# Altium project STM32MP15XXAB_1DDR3Lx16.PrjPcb
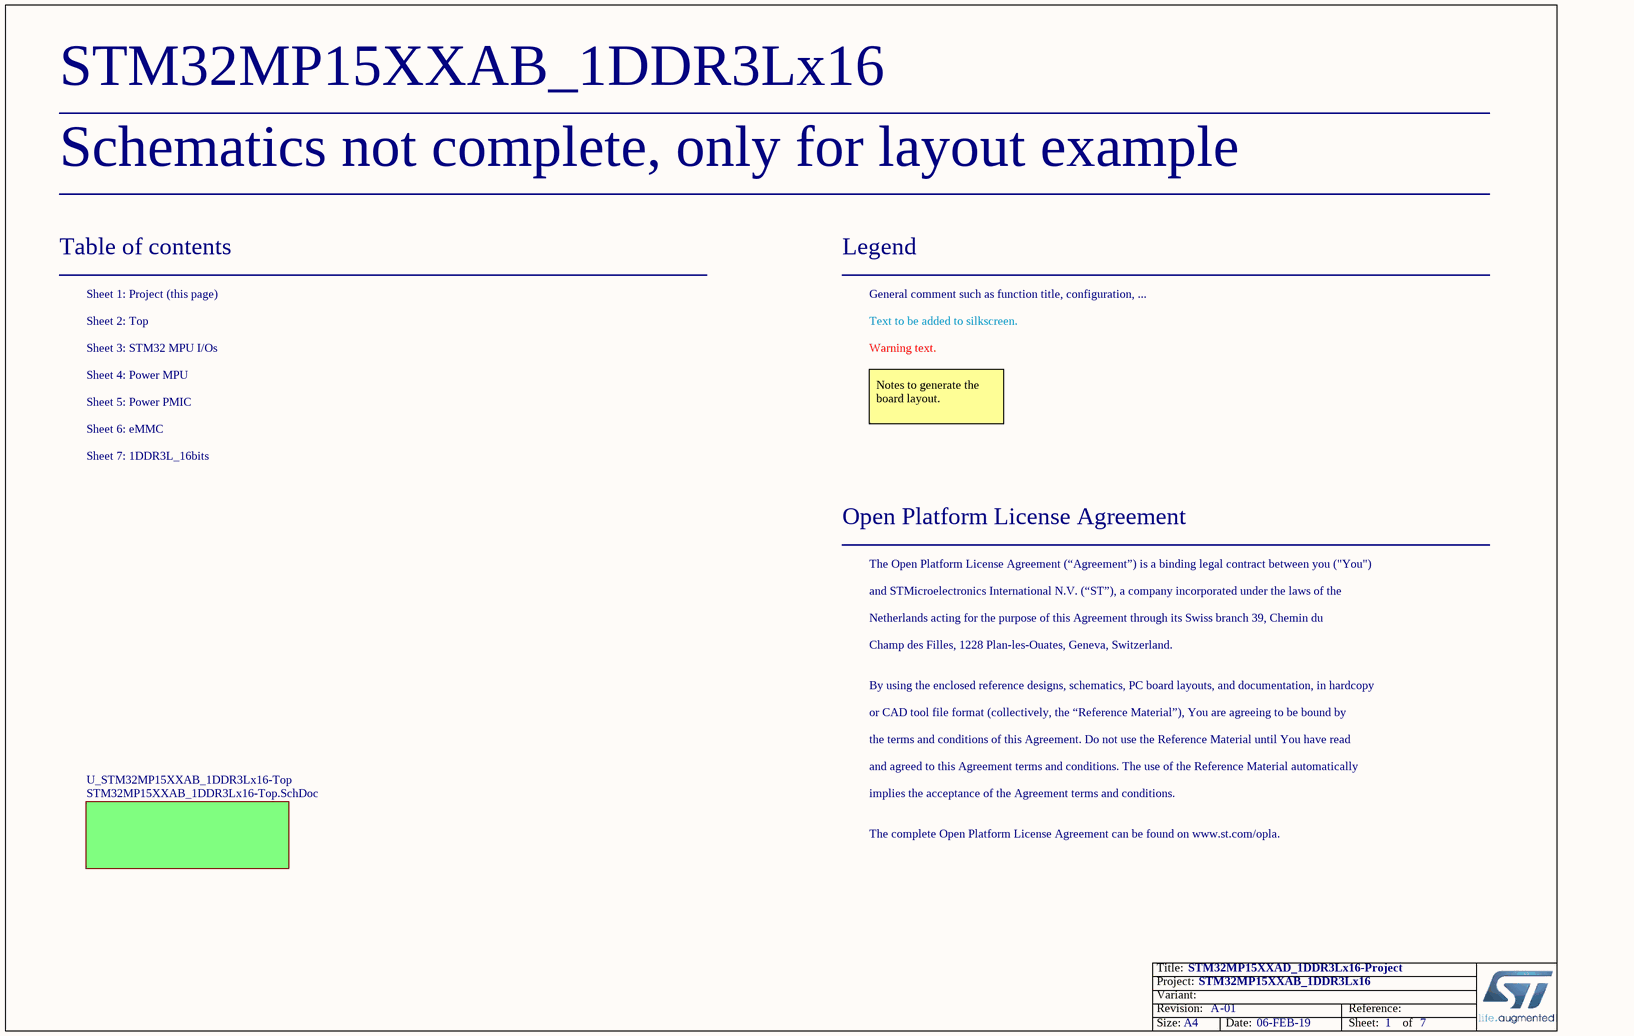
[diagram p0: STM32MP15XXAB_1DDR3Lx16-Project.SchDoc]
Board_Assembly_Revision: 01; Board_Document_Date: 06-FEB-19; Board_Name: STM32MP15XXAB_1DDR3Lx16; Board_PCB_Revision: A
7 sheets, 144 parts. Net scope: flat (ports and power ports of the same name join across sheets).
Board file: STM32MP15XXAB_1DDR3Lx16_A01.PcbDoc
Sheets:
  STM32MP15XXAB_1DDR3Lx16-Project.SchDoc
    U_STM32MP15XXAB_1DDR3Lx16-Top = STM32MP15XXAB_1DDR3Lx16-Top.SchDoc
      U_Power_PMIC = Power_PMIC.SchDoc
      U_Power_MPU = Power_MPU.SchDoc
      U_eMMC = eMMC.SchDoc
      U_STM32_MPU_IOs = STM32_MPU_IOs.SchDoc
      U_1DDR3L_16bits = 1DDR3L_16bits.SchDoc

## Sheet STM32MP15XXAB_1DDR3Lx16-Project.SchDoc: STM32MP15XXAD_1DDR3Lx16-Project
size A4; ApprovedBy: Not used; CheckedBy: Not used; Author: Not used; CompanyName: STMicroelectronics; DrawnBy: Not used; Engineer: Not used; Organization: Not used; Address1: Not used; Address2: Not used; Address3: Not used; Address4: Not used; DocumentNumber: Not used; Revision: Not used; SheetNumber: 1; SheetTotal: 7; CurrentTime: Not used; CurrentDate: Not used; Time: Not used; DocumentFullPathAndName: Not used; DocumentName: Not used; ModifiedDate: Not used; ImagePath: Not used; ProjectName: Not used; Application_BuildNumber: Not used

### Sub-sheets
U_STM32MP15XXAB_1DDR3Lx16-Top = STM32MP15XXAB_1DDR3Lx16-Top.SchDoc: no entries

### Notes on the sheet
- Schematics not complete, only for layout example
- Table of contents
- Sheet 1: Project (this page)
- Legend
- General comment such as function title, configuration, ...
- Sheet 2: Top
- Sheet 3: STM32 MPU I/Os
- Sheet 4: Power MPU
- Text to be added to silkscreen.
- Warning text.
- Sheet 5: Power PMIC
- Sheet 6: eMMC
- Notes to generate the board layout.
- Sheet 7: 1DDR3L_16bits
- Open Platform License Agreement
- The Open Platform License Agreement (“Agreement”) is a binding legal contract between you ("You")
- and STMicroelectronics International N.V. (“ST”), a company incorporated under the laws of the
- Netherlands acting for the purpose of this Agreement through its Swiss branch 39, Chemin du
- Champ des Filles, 1228 Plan-les-Ouates, Geneva, Switzerland.
- By using the enclosed reference designs, schematics, PC board layouts, and documentation, in hardcopy
- or CAD tool file format (collectively, the “Reference Material”), You are agreeing to be bound by
- the terms and conditions of this Agreement. Do not use the Reference Material until You have read
- and agreed to this Agreement terms and conditions. The use of the Reference Material automatically
- implies the acceptance of the Agreement terms and conditions.
- The complete Open Platform License Agreement can be found on www.st.com/opla.
- Title:
- Project:
- Size:
- Revision:
- Variant:
- A4
- -
- Date:
- Reference:
- Sheet:
- of

## Sheet STM32MP15XXAB_1DDR3Lx16-Top.SchDoc: STM32MP15XXAD_1DDR3Lx16-TOP
size A4; Date: Not used; ApprovedBy: Not used; CheckedBy: Not used; Author: Not used; CompanyName: STMicroelectronics; DrawnBy: Not used; Engineer: Not used; Organization: Not used; Address1: Not used; Address2: Not used; Address3: Not used; Address4: Not used; DocumentNumber: Not used; Revision: Not used; SheetNumber: 2; SheetTotal: 7; CurrentTime: Not used; CurrentDate: Not used; Time: Not used; DocumentFullPathAndName: Not used; DocumentName: Not used; ModifiedDate: Not used; ImagePath: Not used; ProjectName: Not used; Application_BuildNumber: Not used
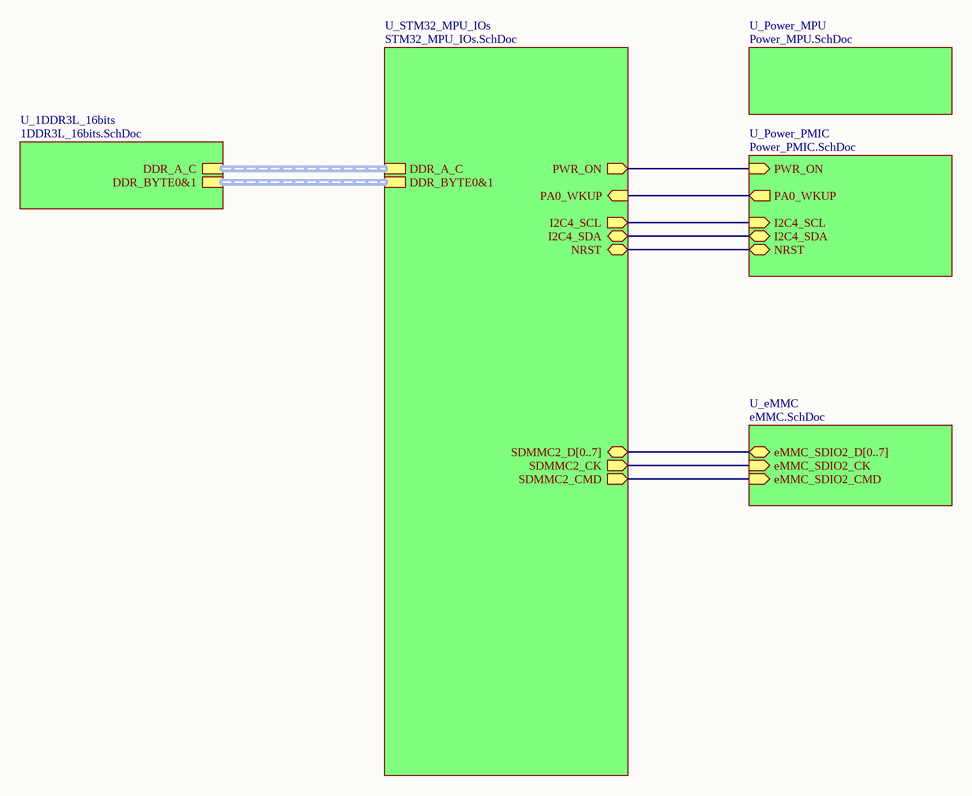
[diagram p1: STM32MP15XXAB_1DDR3Lx16-Top.SchDoc]

### Sub-sheets
U_1DDR3L_16bits = 1DDR3L_16bits.SchDoc: DDR_BYTE0&1 (harness DDR_BYTE_0&1), DDR_A_C (harness DDR_A_C)
U_eMMC = eMMC.SchDoc: eMMC_SDIO2_CK (in), eMMC_SDIO2_D[0..7] (bidir), eMMC_SDIO2_CMD (in)
U_Power_MPU = Power_MPU.SchDoc: no entries
U_Power_PMIC = Power_PMIC.SchDoc: I2C4_SDA (bidir), I2C4_SCL (in), PA0_WKUP (out), NRST (bidir), PWR_ON (in)
U_STM32_MPU_IOs = STM32_MPU_IOs.SchDoc: PA0_WKUP (in), NRST (bidir), PWR_ON (out), I2C4_SCL (out), I2C4_SDA (bidir), DDR_BYTE0&1 (harness DDR_BYTE_0&1), DDR_A_C (harness DDR_A_C), SDMMC2_D[0..7] (bidir), SDMMC2_CMD (out), SDMMC2_CK (out)

### Nets
(unnamed): sheet U_Power_PMIC/I2C4_SDA, sheet U_STM32_MPU_IOs/I2C4_SDA
(unnamed): sheet U_Power_PMIC/I2C4_SCL, sheet U_STM32_MPU_IOs/I2C4_SCL
(unnamed): sheet U_Power_PMIC/PA0_WKUP, sheet U_STM32_MPU_IOs/PA0_WKUP
(unnamed): sheet U_Power_PMIC/NRST, sheet U_STM32_MPU_IOs/NRST
(unnamed): sheet U_Power_PMIC/PWR_ON, sheet U_STM32_MPU_IOs/PWR_ON
(unnamed): sheet U_eMMC/eMMC_SDIO2_CK, sheet U_STM32_MPU_IOs/SDMMC2_CK
(unnamed): sheet U_eMMC/eMMC_SDIO2_CMD, sheet U_STM32_MPU_IOs/SDMMC2_CMD

### Buses and harness runs
bus sheet U_eMMC/eMMC_SDIO2_D[0..7] = sheet U_STM32_MPU_IOs/SDMMC2_D[0..7]
harness sheet U_1DDR3L_16bits/DDR_A_C = sheet U_STM32_MPU_IOs/DDR_A_C
harness sheet U_1DDR3L_16bits/DDR_BYTE0&1 = sheet U_STM32_MPU_IOs/DDR_BYTE0&1

### Notes on the sheet
- Title:
- Project:
- Size:
- Revision:
- Variant:
- A4
- -
- Date:
- Reference:
- Sheet:
- of

## Sheet Power_PMIC.SchDoc: Power_PMIC
size A3; CompanyName: STMicroelectronics; Organization: Microcontrollers Division; Address1: 12, Rue Jules HOROWITZ; Address2: 38019 Grenoble; Address3: FRANCE; SheetNumber: 5; SheetTotal: 7
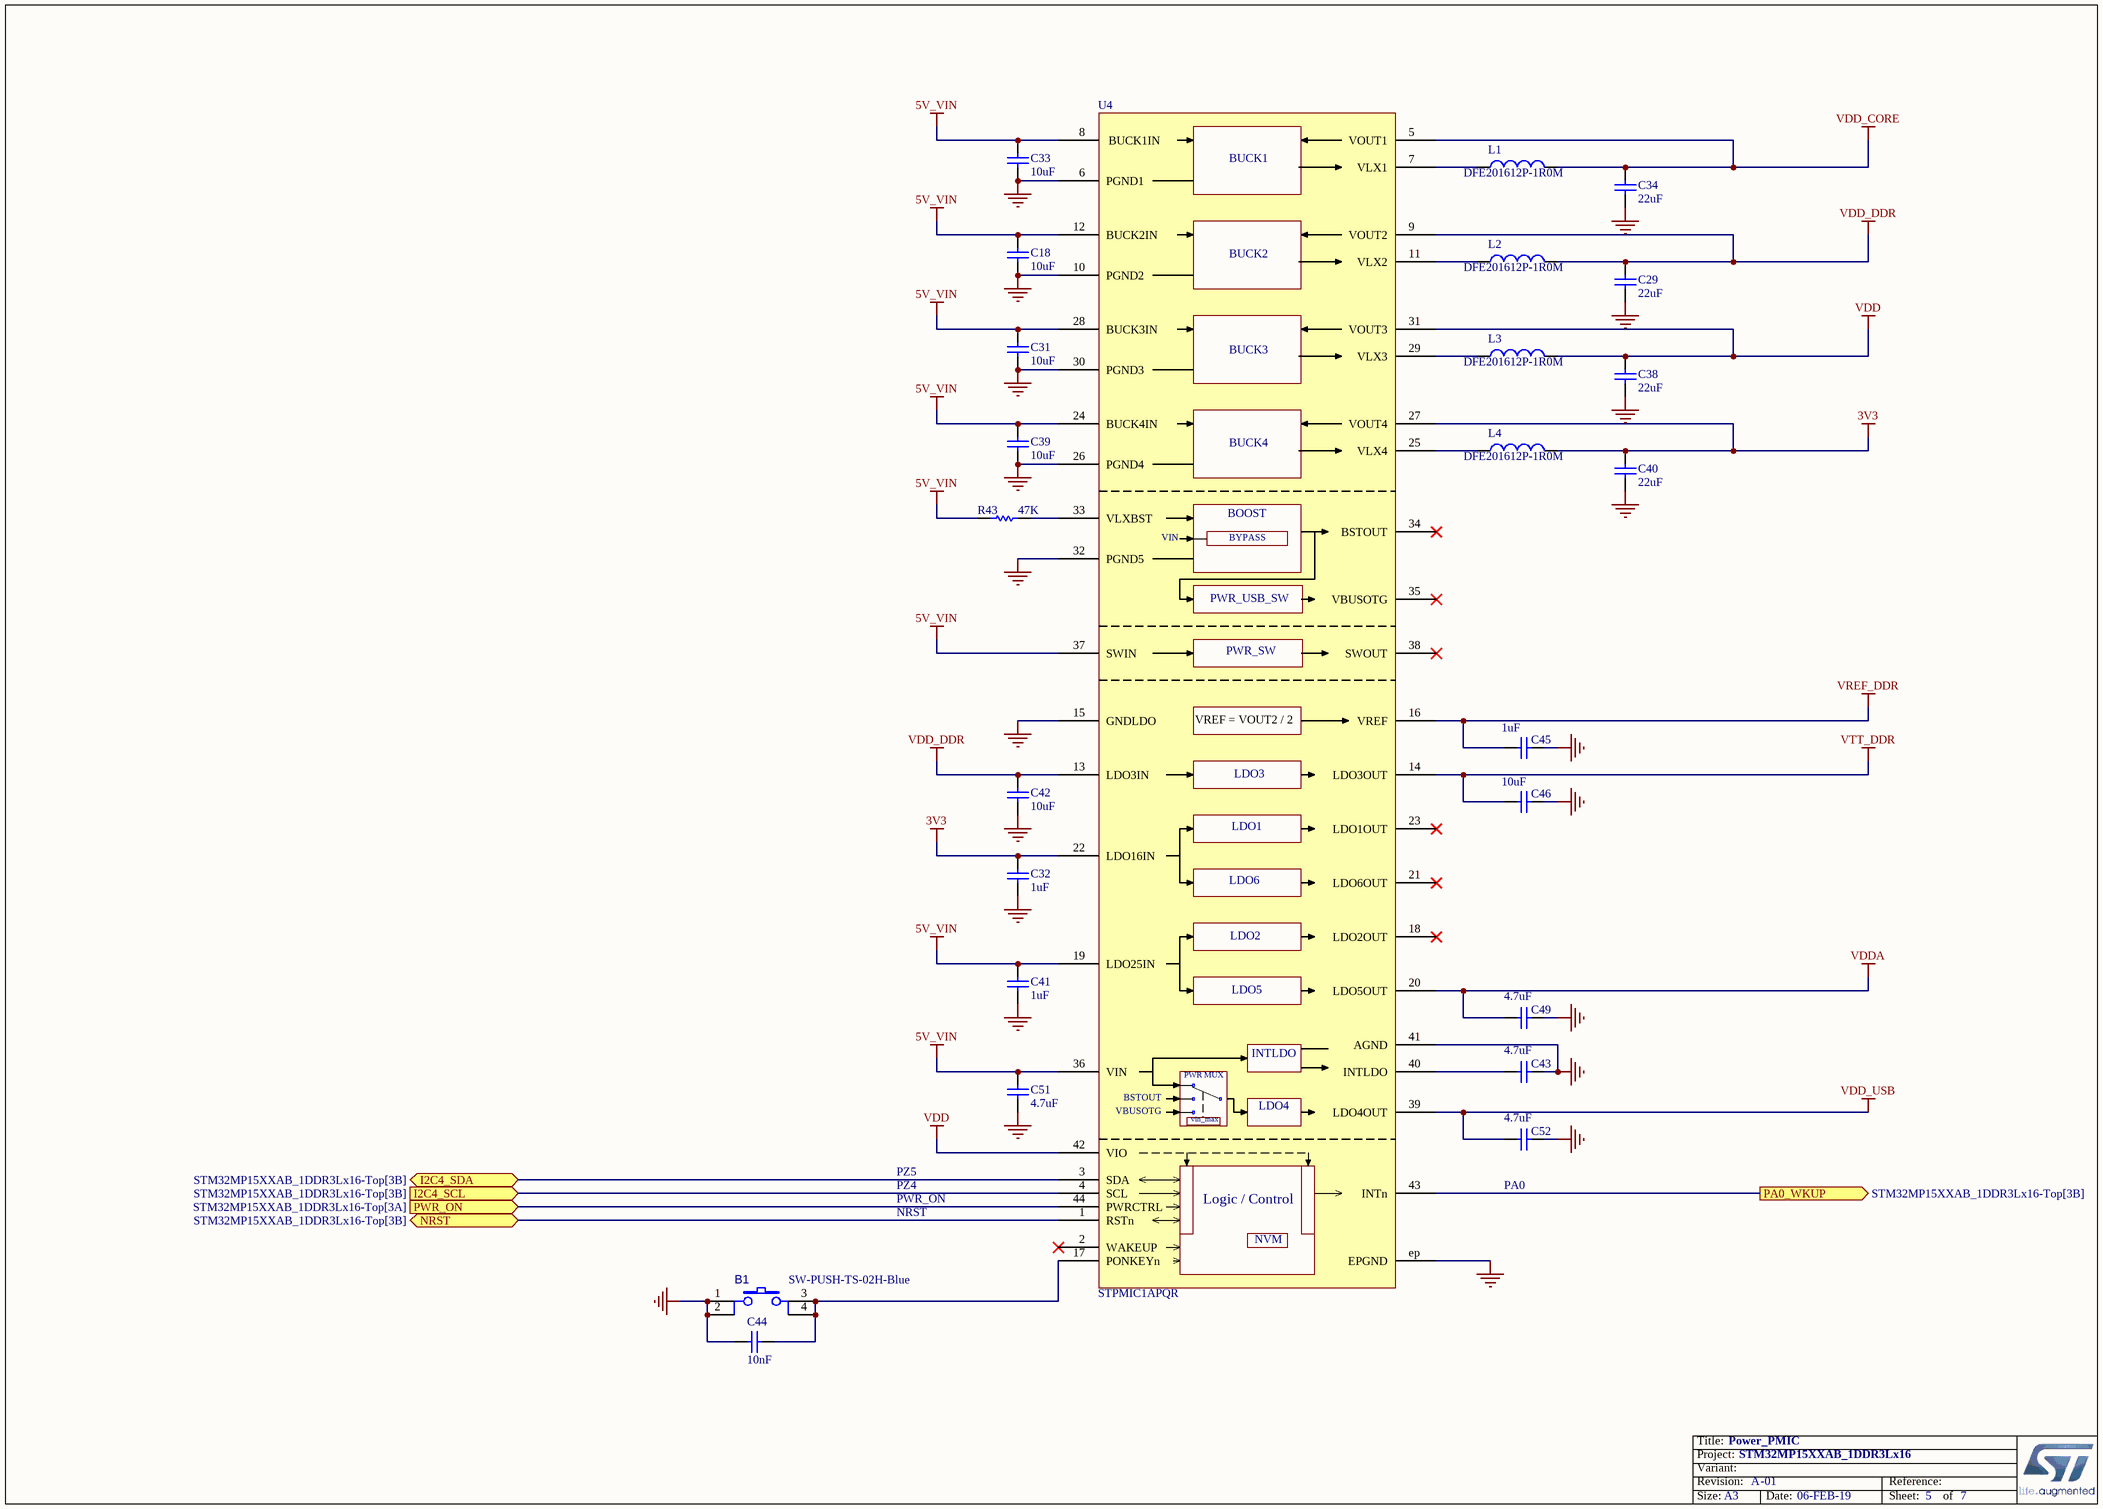
[diagram p2: Power_PMIC.SchDoc]

### Parts
B1  value SW-PUSH-TS-02H-Blue  [SWI_JIUBABA_C-TS-02H-2-5-B-V-T_R_BLUE]
C18  value 10uF  [C0603]
C29  value 22uF  [C0603]
C31  value 10uF  [C0603]
C32  value 1uF  [C0402]
C33  value 10uF  [C0603]
C34  value 22uF  [C0603]
C38  value 22uF  [C0603]
C39  value 10uF  [C0603]
C40  value 22uF  [C0603]
C41  value 1uF  [C0402]
C42  value 10uF  [C0603]
C43  value 4.7uF  [C0402]
C44  value 10nF  [C0402]
C45  value 1uF  [C0402]
C46  value 10uF  [C0603]
C49  value 4.7uF  [C0402]
C51  value 4.7uF  [C0402]
C52  value 4.7uF  [C0402]
L1  value DFE201612P-1R0M  [IND_MURATA_DFE201612P]
L2  value DFE201612P-1R0M  [IND_MURATA_DFE201612P]
L3  value DFE201612P-1R0M  [IND_MURATA_DFE201612P]
L4  value DFE201612P-1R0M  [IND_MURATA_DFE201612P]
R43  value 47K  [R0402]
U4  value STPMIC1APQR  [ICC_WFQFN44-EPAD_5X6_P040]

### Ports
I2C4_SCL (in, see STM32MP15XXAB_1DDR3Lx16-Top[3B]), I2C4_SDA (bidir, see STM32MP15XXAB_1DDR3Lx16-Top[3B]), NRST (bidir, see STM32MP15XXAB_1DDR3Lx16-Top[3B]), PA0_WKUP (out, see STM32MP15XXAB_1DDR3Lx16-Top[3B]), PWR_ON (in, see STM32MP15XXAB_1DDR3Lx16-Top[3A])

### Nets
3V3: C32.2 C40.2 L4.2 U4.22(LDO16IN) U4.27(VOUT4)
5V_VIN: C18.2 C31.2 C33.2 C39.2 C41.2 C51.1 R43.2 U4.8(BUCK1IN) U4.12(BUCK2IN) U4.19(LDO25IN) U4.24(BUCK4IN) U4.28(BUCK3IN) U4.36(VIN) U4.37(SWIN)
GND: B1.1 B1.2 C18.1 C29.1 C31.1 C32.1 C33.1 C34.1 C38.1 C39.1 C40.1 C41.1 C42.1 C43.1 C44.1 C45.1 C46.1 C49.1 C51.2 C52.1 U4.6(PGND1) U4.10(PGND2) U4.15(GNDLDO) U4.26(PGND4) U4.30(PGND3) U4.32(PGND5) U4.41(AGND) U4.ep(EPGND)
VDD: C38.2 L3.2 U4.31(VOUT3) U4.42(VIO)
VDD_CORE: C34.2 L1.2 U4.5(VOUT1)
VDD_DDR: C29.2 C42.2 L2.2 U4.9(VOUT2) U4.13(LDO3IN)
VDD_USB: C52.2 U4.39(LDO4OUT)
VDDA: C49.2 U4.20(LDO5OUT)
VREF_DDR: C45.2 U4.16(VREF)
VTT_DDR: C46.2 U4.14(LDO3OUT)
I2C4_SCL: U4.4(SCL) ; port I2C4_SCL
I2C4_SDA: U4.3(SDA) ; port I2C4_SDA
NRST: U4.1(RSTn) ; port NRST
PA0_WKUP: U4.43(INTn) ; port PA0_WKUP
PWR_ON: U4.44(PWRCTRL) ; port PWR_ON
NetB1_3: B1.3 B1.4 C44.2 U4.17(PONKEYn)
NetC43_2: C43.2 U4.40(INTLDO)
NetL1_1: L1.1 U4.7(VLX1)
NetL2_1: L2.1 U4.11(VLX2)
NetL3_1: L3.1 U4.29(VLX3)
NetL4_1: L4.1 U4.25(VLX4)
NetR43_1: R43.1 U4.33(VLXBST)

Not connected (* = marked no-connect by the designer): U4 2(WAKEUP)* 18(LDO2OUT)* 21(LDO6OUT)* 23(LDO1OUT)* 34(BSTOUT)* 35(VBUSOTG)* 38(SWOUT)*

### Notes on the sheet
- PZ5
- PZ4
- (near C52) PA0
- NRST
- PWR_ON
- Title:
- Project:
- Size:
- Revision:
- Variant:
- A3
- -
- Date:
- Reference:
- Sheet:
- of
- (in symbol MCD-01650) BUCK1; BUCK2; BUCK3; BUCK4; BOOST; BYPASS; PWR_USB_SW; PWR_SW; VREF = VOUT2 / 2; LDO3; LDO1; LDO6; LDO2; LDO5; PWR MUX; LDO4; vin_max; Logic / Control; NVM

### Library data of the parts
B1 = MCD-00172: Switch HW SMD blue; Part_Type: Misc; Manufacturer_Part_Number: C-TS-02H-2.5-B-V-T/R BLUE; Manufacturer: JIUBABA; Provided_By: SUBCO; Internal_Part_Number: MCD-00172; Status: Checked; ComponentLink1Description: Datasheet; ComponentLink1URL: http://tunmcdsvn.tun.st.com/Component_Datasheet_Library/Trunk/Misc/Jiubaba_TS-02H-H2-5; ECCN_US: n/a; ECCN_EU: n/a
C18 C31 C33 C39 C42 C46 = MCD-00099: Capacitor, MLCC, 10uF, 10V, X5R, 10%, 0603, T=0,8mm; Manufacturer_Part_Number: GRM188R61A106KE69D; Manufacturer: MURATA; Provided_By: SUBCO; ECCN_US: EAR99; ECCN_EU: NEC; Internal_Part_Number: MCD-00099; Status: Released; Part_Type: Capacitor; Package: C0603; ComponentLink1Description: Datasheet; ComponentLink1URL: http://tunmcdsvn.tun.st.com/Component_Datasheet_Library/Trunk/Capacitors/Murata_Capacitor_GR_series
C29 C34 C38 C40 = MCD-00100: Capacitor, MLCC, 22uF, 6V3, X5R, 20%, 0603, T=0,8mm; Manufacturer_Part_Number: GRM188R60J226MEA0J; Manufacturer: MURATA; Provided_By: SUBCO; ECCN_US: EAR99; ECCN_EU: NEC; Internal_Part_Number: MCD-00100; Status: Released; Part_Type: Capacitor; Package: C0603; ComponentLink1Description: Datasheet; ComponentLink1URL: http://tunmcdsvn.tun.st.com/Component_Datasheet_Library/Trunk/Capacitors/Murata_Capacitor_GR_series
C32 C41 C45 = MCD-00095: Capacitor, MLCC, 1uF, 6V3, X5R, 10%, 0402, T=0,5mm; Manufacturer_Part_Number: GRM155R61E105KA12; Manufacturer: MURATA; Alternate_Manufacturer_Part_Number: GRM155R60J105KE19; Provided_By: SUBCO; ECCN_US: EAR99; ECCN_EU: NEC; Internal_Part_Number: MCD-00095; Status: Released; Part_Type: Capacitor; Package: C0402; ComponentLink1Description: Datasheet; ComponentLink1URL: http://tunmcdsvn.tun.st.com/Component_Datasheet_Library/Trunk/Capacitors/Murata_Capacitor_GR_series; Alternate_Manufacturer: MURATA
C43 C49 C51 C52 = MCD-01356: Capacitor, MLCC, 4.7uF, 6V3, X5R, 20%, 0402, T=0,5mm; Manufacturer_Part_Number: GRM155R60J475ME47; Manufacturer: MURATA; Provided_By: SUBCO; ECCN_US: EAR99; ECCN_EU: NEC; Internal_Part_Number: MCD-01356; Status: Released; Part_Type: Capacitor; Package: C0402; ComponentLink1Description: Datasheet; ComponentLink1URL: http://tunmcdsvn.tun.st.com/Component_Datasheet_Library/Trunk/Capacitors/Murata_Capacitor_GR_series
C44 = MCD-00011: Capacitor, MLCC, 10nF, 16V, X7R, 10%, 0402, T=0.5mm; Manufacturer_Part_Number: CC0402KRX7R7BB103; Manufacturer: YAGEO; Provided_By: SUBCO; ECCN_US: EAR99; ECCN_EU: NEC; Internal_Part_Number: MCD-00011; Status: Released; Part_Type: Capacitor; Package: C0402; ComponentLink1Description: Datasheet; ComponentLink1URL: http://tunmcdsvn.tun.st.com/Component_Datasheet_Library/Trunk/Capacitors/Yageo_Multilayer_Capacitor_X7R_series_100pF_to_22uF
L1-L4 = MCD-01491: Inductors 1.0uH 54mOhms3.3A +/-20% 2016; Manufacturer: MURATA; Provided_By: SUBCO; Internal_Part_Number: MCD-01491; Status: Footprint available; Part_Type: Inductor; Manufacturer_Part_Number: DFE201612P-1R0M; Package: 2016; ComponentLink1Description: Datasheet; ComponentLink1URL: http://tunmcdsvn.tun.st.com/Component_Datasheet_Library/Trunk/Inductors/Murata_Inductor_DFE201612P-1ROM/Murata_inductor_DFE201612P-1R0M.pdf; ECCN_US: n/a; ECCN_EU: n/a
R43 = MCD-00063: Resistor,47K,0402,1%,1/16W; Manufacturer_Part_Number: RC0402FR-0747KL; Manufacturer: YAGEO; Provided_By: SUBCO; ECCN_US: EAR99; ECCN_EU: NEC; Internal_Part_Number: MCD-00063; Status: Released; Part_Type: Resistor; Package: R0402; ComponentLink1Description: Datasheet; ComponentLink1URL: http://tunmcdsvn.tun.st.com/Component_Datasheet_Library/Trunk/Resistors/Yageo_Resistor_RC0402-series
U4 = MCD-01650: ST PMIC:  4 step-down + 1 advanced boost SMPS, 6 LDOs, 2 pwr switches, DDR Vref, NVM option 'A' for IO@3.3V; Part_Type: IC; Manufacturer: STMICROELECTRONICS; ECCN_US: EAR99; ECCN_EU: NEC; Provided_By: SUBCO with ST control; Internal_Part_Number: MCD-01650; Status: Footprint available; Manufacturer_Part_Number: STPMIC1APQR; Package: WFQFN 5.0x6.0x0.80mm; ComponentLink1Description: Datasheet; ComponentLink1URL: http://tunmcdsvn.tun.st.com/Component_Datasheet_Library/Trunk/IC/STM_PMIC_LuftBurg_5x6_44L_20_01_2016

## Sheet Power_MPU.SchDoc: Power_MPU
size A3; CompanyName: STMicroelectronics; SheetNumber: 4; SheetTotal: 7
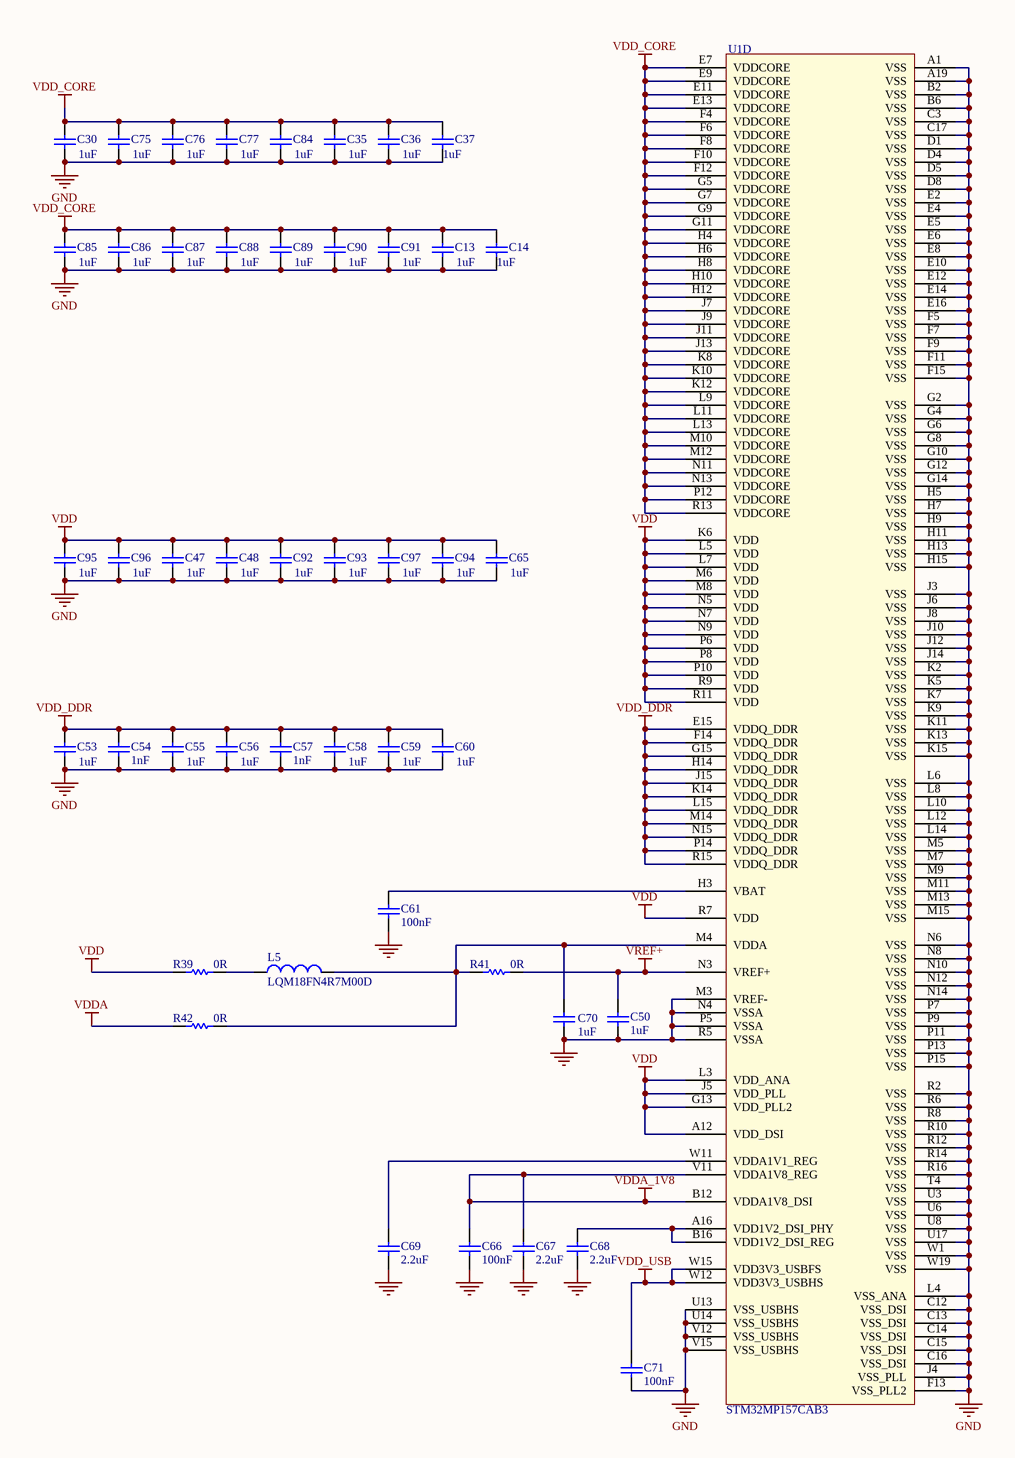
[diagram p3: Power_MPU.SchDoc]

### Parts
C13  value 1uF  [C0402]
C14  value 1uF  [C0402]
C30  value 1uF  [C0402]
C35  value 1uF  [C0402]
C36  value 1uF  [C0402]
C37  value 1uF  [C0402]
C47  value 1uF  [C0402]
C48  value 1uF  [C0402]
C50  value 1uF  [C0402]
C53  value 1uF  [C0402]
C54  value 1nF  [C0402]
C55  value 1uF  [C0402]
C56  value 1uF  [C0402]
C57  value 1nF  [C0402]
C58  value 1uF  [C0402]
C59  value 1uF  [C0402]
C60  value 1uF  [C0402]
C61  value 100nF  [C0402]
C65  value 1uF  [C0402]
C66  value 100nF  [C0402]
C67  value 2.2uF  [C0402]  (hidden comment: Capacitor)
C68  value 2.2uF  [C0402]  (hidden comment: Capacitor)
C69  value 2.2uF  [C0402]  (hidden comment: Capacitor)
C70  value 1uF  [C0402]
C71  value 100nF  [C0402]
C75  value 1uF  [C0402]
C76  value 1uF  [C0402]
C77  value 1uF  [C0402]
C84  value 1uF  [C0402]
C85  value 1uF  [C0402]
C86  value 1uF  [C0402]
C87  value 1uF  [C0402]
C88  value 1uF  [C0402]
C89  value 1uF  [C0402]
C90  value 1uF  [C0402]
C91  value 1uF  [C0402]
C92  value 1uF  [C0402]
C93  value 1uF  [C0402]
C94  value 1uF  [C0402]
C95  value 1uF  [C0402]
C96  value 1uF  [C0402]
C97  value 1uF  [C0402]
L5  value LQM18FN4R7M00D  [L0603_H0P8]
R39  value 0R  [R0402]
R41  value 0R  [R0402]
R42  value 0R  [R0402]
U1  value STM32MP157CAB3  [ICC_LFBGA354_16X16_STM32MP157CAB3_P080]  (part D of 5)

### Nets
GND: C13.1 C14.1 C30.1 C35.1 C36.1 C37.1 C47.1 C48.1 C50.1 C53.1 C54.1 C55.1 C56.1 C57.1 C58.1 C59.1 C60.1 C61.1 C65.1 C66.1 C67.1 C68.1 C69.1 C70.1 C71.1 C75.1 C76.1 C77.1 C84.1 C85.1 C86.1 C87.1 C88.1 C89.1 C90.1 C91.1 C92.1 C93.1 C94.1 C95.1 C96.1 C97.1 U1.A1(VSS) U1.A19(VSS) U1.B2(VSS) U1.B6(VSS) U1.C3(VSS) U1.C12(VSS_DSI) U1.C13(VSS_DSI) U1.C14(VSS_DSI) U1.C15(VSS_DSI) U1.C16(VSS_DSI) U1.C17(VSS) U1.D1(VSS) U1.D4(VSS) U1.D5(VSS) U1.D8(VSS) U1.E2(VSS) U1.E4(VSS) U1.E5(VSS) U1.E6(VSS) U1.E8(VSS) U1.E10(VSS) U1.E12(VSS) U1.E14(VSS) U1.E16(VSS) U1.F5(VSS) U1.F7(VSS) U1.F9(VSS) U1.F11(VSS) U1.F13(VSS_PLL2) U1.F15(VSS) U1.G2(VSS) U1.G4(VSS) U1.G6(VSS) U1.G8(VSS) U1.G10(VSS) U1.G12(VSS) U1.G14(VSS) U1.H5(VSS) U1.H7(VSS) U1.H9(VSS) U1.H11(VSS) U1.H13(VSS) U1.H15(VSS) U1.J3(VSS) U1.J4(VSS_PLL) U1.J6(VSS) U1.J8(VSS) U1.J10(VSS) U1.J12(VSS) U1.J14(VSS) U1.K2(VSS) U1.K5(VSS) U1.K7(VSS) U1.K9(VSS) U1.K11(VSS) U1.K13(VSS) U1.K15(VSS) U1.L4(VSS_ANA) U1.L6(VSS) U1.L8(VSS) U1.L10(VSS) U1.L12(VSS) U1.L14(VSS) U1.M3(VREF-) U1.M5(VSS) U1.M7(VSS) U1.M9(VSS) U1.M11(VSS) U1.M13(VSS) U1.M15(VSS) U1.N4(VSSA) U1.N6(VSS) U1.N8(VSS) U1.N10(VSS) U1.N12(VSS) U1.N14(VSS) U1.P5(VSSA) U1.P7(VSS) U1.P9(VSS) U1.P11(VSS) U1.P13(VSS) U1.P15(VSS) U1.R2(VSS) U1.R5(VSSA) U1.R6(VSS) U1.R8(VSS) U1.R10(VSS) U1.R12(VSS) U1.R14(VSS) U1.R16(VSS) U1.T4(VSS) U1.U3(VSS) U1.U6(VSS) U1.U8(VSS) U1.U13(VSS_USBHS) U1.U14(VSS_USBHS) U1.U17(VSS) U1.V12(VSS_USBHS) U1.V15(VSS_USBHS) U1.W1(VSS) U1.W19(VSS)
VDD: C47.2 C48.2 C65.2 C92.2 C93.2 C94.2 C95.2 C96.2 C97.2 R39.1 U1.A12(VDD_DSI) U1.G13(VDD_PLL2) U1.J5(VDD_PLL) U1.K6(VDD) U1.L3(VDD_ANA) U1.L5(VDD) U1.L7(VDD) U1.M6(VDD) U1.M8(VDD) U1.N5(VDD) U1.N7(VDD) U1.N9(VDD) U1.P6(VDD) U1.P8(VDD) U1.P10(VDD) U1.R7(VDD) U1.R9(VDD) U1.R11(VDD)
VDD_CORE: C13.2 C14.2 C30.2 C35.2 C36.2 C37.2 C75.2 C76.2 C77.2 C84.2 C85.2 C86.2 C87.2 C88.2 C89.2 C90.2 C91.2 U1.E7(VDDCORE) U1.E9(VDDCORE) U1.E11(VDDCORE) U1.E13(VDDCORE) U1.F4(VDDCORE) U1.F6(VDDCORE) U1.F8(VDDCORE) U1.F10(VDDCORE) U1.F12(VDDCORE) U1.G5(VDDCORE) U1.G7(VDDCORE) U1.G9(VDDCORE) U1.G11(VDDCORE) U1.H4(VDDCORE) U1.H6(VDDCORE) U1.H8(VDDCORE) U1.H10(VDDCORE) U1.H12(VDDCORE) U1.J7(VDDCORE) U1.J9(VDDCORE) U1.J11(VDDCORE) U1.J13(VDDCORE) U1.K8(VDDCORE) U1.K10(VDDCORE) U1.K12(VDDCORE) U1.L9(VDDCORE) U1.L11(VDDCORE) U1.L13(VDDCORE) U1.M10(VDDCORE) U1.M12(VDDCORE) U1.N11(VDDCORE) U1.N13(VDDCORE) U1.P12(VDDCORE) U1.R13(VDDCORE)
VDD_DDR: C53.2 C54.2 C55.2 C56.2 C57.2 C58.2 C59.2 C60.2 U1.E15(VDDQ_DDR) U1.F14(VDDQ_DDR) U1.G15(VDDQ_DDR) U1.H14(VDDQ_DDR) U1.J15(VDDQ_DDR) U1.K14(VDDQ_DDR) U1.L15(VDDQ_DDR) U1.M14(VDDQ_DDR) U1.N15(VDDQ_DDR) U1.P14(VDDQ_DDR) U1.R15(VDDQ_DDR)
VDD_USB: C71.2 U1.W12(VDD3V3_USBHS) U1.W15(VDD3V3_USBFS)
VDDA: R42.1
VDDA_1V8: C66.2 C67.2 U1.B12(VDDA1V8_DSI) U1.V11(VDDA1V8_REG)
VREF+: C50.2 R41.2 U1.N3(VREF+)
NetC61_2: C61.2 U1.H3(VBAT)
NetC68_2: C68.2 U1.A16(VDD1V2_DSI_PHY) U1.B16(VDD1V2_DSI_REG)
NetC69_2: C69.2 U1.W11(VDDA1V1_REG)
NetC70_2: C70.2 L5.2 R41.1 R42.2 U1.M4(VDDA)
NetL5_1: L5.1 R39.2

### Notes on the sheet
- Title:
- Project:
- Size:
- Revision:
- Variant:
- A3
- -
- Date:
- Reference:
- Sheet:
- of

### Library data of the parts
C13 C14 C30 C35-C37 C47 C48 C50 C53 C55 C56 C58-C60 C65 C70 C75-C77 C84-C97 = MCD-00095: as C32 on sheet Power_PMIC; Internal_Part_Number: MCD-00095; Status: Released; Package: C0402; ComponentLink1Description: Datasheet; Part_Type: Capacitor; Alternate_Manufacturer: MURATA; ComponentLink1URL: http://tunmcdsvn.tun.st.com/Component_Datasheet_Library/Trunk/Capacitors/Murata_Capacitor_GR_series
C54 C57 = MCD-00198: Capacitor, MLCC, 1nF, 16V, X7R, 10%, 0402, T=0.5mm; Manufacturer_Part_Number: CC0402KRX7R7BB102; Manufacturer: YAGEO; Provided_By: SUBCO; ECCN_US: EAR99; ECCN_EU: NEC; Internal_Part_Number: MCD-00198; Status: Released; Part_Type: Capacitor; Package: C0402; ComponentLink1Description: Datasheet; ComponentLink1URL: http://tunmcdsvn.tun.st.com/Component_Datasheet_Library/Trunk/Capacitors/Yageo_Multilayer_Capacitor_X7R_series_100pF_to_22uF
C61 C66 C71 = MCD-00006: Capacitor, MLCC, 100nF, 16V, X7R, 10%, 0402, T=0.5mm; Manufacturer_Part_Number: CC0402KRX7R7BB104; Manufacturer: YAGEO; Alternate_Manufacturer_Part_Number: GCM155R71C104KA55D; Alternate_Manufacturer: MURATA; Provided_By: SUBCO; ECCN_US: EAR99; ECCN_EU: NEC; Internal_Part_Number: MCD-00006; ComponentLink1Description: Datasheet; Status: Released; Part_Type: Capacitor; Package: C0402; ComponentLink1URL: http://tunmcdsvn.tun.st.com/Component_Datasheet_Library/Trunk/Capacitors/Yageo_Multilayer_Capacitor_X7R_series_100pF_to_22uF
C67-C69 = MCD-01823: Capacitor,MLCC,2.2uF,6V3,X5R,10%,0402,T=0.5; Manufacturer_Part_Number: GRM155R60J225KE95D; Manufacturer: MURATA; ECCN_US: EAR99; ECCN_EU: NEC; Provided_By: SUBCO; Internal_Part_Number: MCD-01823; Status: Checked; Part_Type: Capacitor; Package: C0402; ComponentLink1Description: Datasheet; ComponentLink1URL: http://tunmcdsvn.tun.st.com/Component_Datasheet_Library/Trunk/Capacitors/Murata_Capacitor_GR_series
L5 = MCD-01134: IND 4.7uH 20% 80mA 600mhom 0603; Part_Type: Inductor; Manufacturer: MURATA; Provided_By: SUBCO; Internal_Part_Number: MCD-01134; Status: Footprint available; Manufacturer_Part_Number: LQM18FN4R7M00D; Package: 0603; ComponentLink1Description: Datasheet; ComponentLink1URL: http://tunmcdsvn.tun.st.com/Component_Datasheet_Library/Trunk/Inductors/Murata_inductor_LQM18FN4R7M00D; ECCN_US: n/a; ECCN_EU: n/a
R39 R41 R42 = MCD-00052: Resistor,0R,0402,5%,1/16W; Manufacturer_Part_Number: RC0402JR-070RL; Manufacturer: YAGEO; Provided_By: SUBCO; ECCN_US: EAR99; ECCN_EU: NEC; Internal_Part_Number: MCD-00052; Status: Released; Part_Type: Resistor; ComponentLink1Description: Datasheet; ComponentLink1URL: http://tunmcdsvn.tun.st.com/Component_Datasheet_Library/Trunk/Resistors/Yageo_Resistor_RC0402-series; Package: R0402
U1 = MCD-01805: MPU LFBGA 16x16x1.271 PITCH 0.8 mm secure boot + crypto; Part_Type: IC; Manufacturer: STMICROELECTRONICS; ECCN_US: 5A002A4; ECCN_EU: NEC; Provided_By: SUBCO with ST control; Internal_Part_Number: MCD-01805; Status: Checked; Manufacturer_Part_Number: STM32MP157CAB3; Package: LFBGA; ComponentLink1Description: Datasheet; ComponentLink1URL: TBD

## Sheet eMMC.SchDoc: eMMC
size A3; CompanyName: STMicroelectronics; Address1: 12, Rue Jules HOROWITZ; Address2: 38019 Grenoble; Address3: FRANCE; SheetNumber: 6; SheetTotal: 7
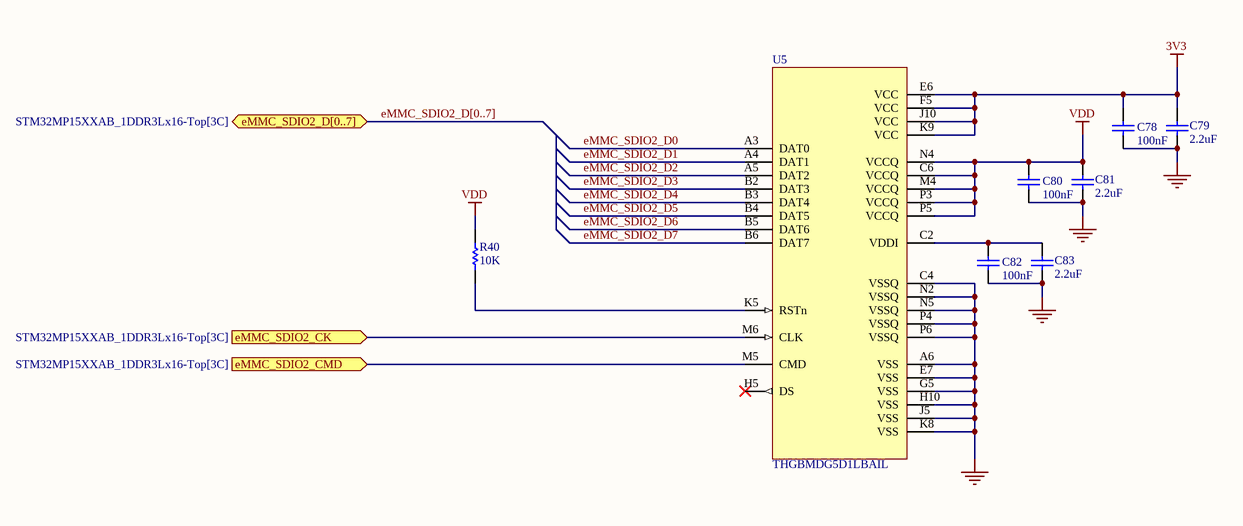
[diagram p4: eMMC.SchDoc]

### Parts
C78  value 100nF  [C0402]
C79  value 2.2uF  [C0603]
C80  value 100nF  [C0402]
C81  value 2.2uF  [C0603]
C82  value 100nF  [C0402]
C83  value 2.2uF  [C0603]
R40  value 10K  [R0402]
U5  value THGBMDG5D1LBAIL  [ICC_P-WFBGA153_13X11P5_P050]

### Ports
eMMC_SDIO2_CK (in, see STM32MP15XXAB_1DDR3Lx16-Top[3C]), eMMC_SDIO2_CMD (in, see STM32MP15XXAB_1DDR3Lx16-Top[3C]), eMMC_SDIO2_D[0..7] (bidir, see STM32MP15XXAB_1DDR3Lx16-Top[3C])

### Nets
3V3: C78.2 C79.2 U5.E6(VCC) U5.F5(VCC) U5.J10(VCC) U5.K9(VCC)
GND: C78.1 C79.1 C80.1 C81.1 C82.1 C83.1 U5.A6(VSS) U5.C4(VSSQ) U5.E7(VSS) U5.G5(VSS) U5.H10(VSS) U5.J5(VSS) U5.K8(VSS) U5.N2(VSSQ) U5.N5(VSSQ) U5.P4(VSSQ) U5.P6(VSSQ)
VDD: C80.2 C81.2 R40.2 U5.C6(VCCQ) U5.M4(VCCQ) U5.N4(VCCQ) U5.P3(VCCQ) U5.P5(VCCQ)
eMMC_SDIO2_CK: U5.M6(CLK) ; port eMMC_SDIO2_CK
eMMC_SDIO2_CMD: U5.M5(CMD) ; port eMMC_SDIO2_CMD
eMMC_SDIO2_D0: U5.A3(DAT0)
eMMC_SDIO2_D1: U5.A4(DAT1)
eMMC_SDIO2_D2: U5.A5(DAT2)
eMMC_SDIO2_D3: U5.B2(DAT3)
eMMC_SDIO2_D4: U5.B3(DAT4)
eMMC_SDIO2_D5: U5.B4(DAT5)
eMMC_SDIO2_D6: U5.B5(DAT6)
eMMC_SDIO2_D7: U5.B6(DAT7)
NetC82_2: C82.2 C83.2 U5.C2(VDDI)
NetR40_1: R40.1 U5.K5(RSTn)

Not connected (* = marked no-connect by the designer): U5 H5(DS)*

### Buses and harness runs
bus eMMC_SDIO2_D[0..7] = port eMMC_SDIO2_D[0..7]

### Notes on the sheet
- Title:
- Project:
- Size:
- Revision:
- Variant:
- A3
- -
- Date:
- Reference:
- Sheet:
- of

### Library data of the parts
C78 C80 C82 = MCD-00006: as C61 on sheet Power_MPU; Internal_Part_Number: MCD-00006; Status: Released; Part_Type: Capacitor; Package: C0402; ComponentLink1Description: Datasheet; ComponentLink1URL: http://tunmcdsvn.tun.st.com/Component_Datasheet_Library/Trunk/Capacitors/Yageo_Multilayer_Capacitor_X7R_series_100pF_to_22uF
C79 C81 C83 = MCD-00012: Capacitor, MLCC, 2.2uF, 10V, X5R, 10%, 0603, T=0,8mm; Manufacturer_Part_Number: CC0603KRX5R6BB225; Manufacturer: YAGEO; Alternate_Manufacturer_Part_Number: C0603C225K8PACTU; Alternate_Manufacturer: KEMET; Provided_By: SUBCO; ECCN_US: EAR99; ECCN_EU: NEC; Internal_Part_Number: MCD-00012; Status: Released; Part_Type: Capacitor; Package: C0603; ComponentLink1Description: Datasheet; ComponentLink1URL: http://tunmcdsvn.tun.st.com/Component_Datasheet_Library/Trunk/Capacitors/Yageo_Multilayer_capacitor_X5R_series_100pF_to_100uF
R40 = MCD-00053: Resistor,10K,0402,1%,1/16W; Manufacturer_Part_Number: RC0402FR-0710KL; Manufacturer: YAGEO; Provided_By: SUBCO; ECCN_US: EAR99; ECCN_EU: NEC; Internal_Part_Number: MCD-00053; Status: Released; Part_Type: Resistor; Package: R0402; ComponentLink1Description: Datasheet; ComponentLink1URL: http://tunmcdsvn.tun.st.com/Component_Datasheet_Library/Trunk/Resistors/Yageo_Resistor_RC0402-series
U5 = MCD-00110: Memory,e-MMC,4GB,3V3,WFBGA,153pins; Part_Type: IC; Manufacturer: TOSHIBA; Provided_By: SUBCO; ECCN_US: 3A991; ECCN_EU: NEC; Internal_Part_Number: MCD-00110; Status: Released; Manufacturer_Part_Number: THGBMDG5D1LBAIL; ComponentLink1Description: Datasheet; ComponentLink1URL: http://tunmcdsvn.tun.st.com/Component_Datasheet_Library/Trunk/IC/Toshiba_eMMC_THGBMDG5D1LBAIL_20151201

## Sheet STM32_MPU_IOs.SchDoc: MPU
size A3; SheetNumber: 3; SheetTotal: 7
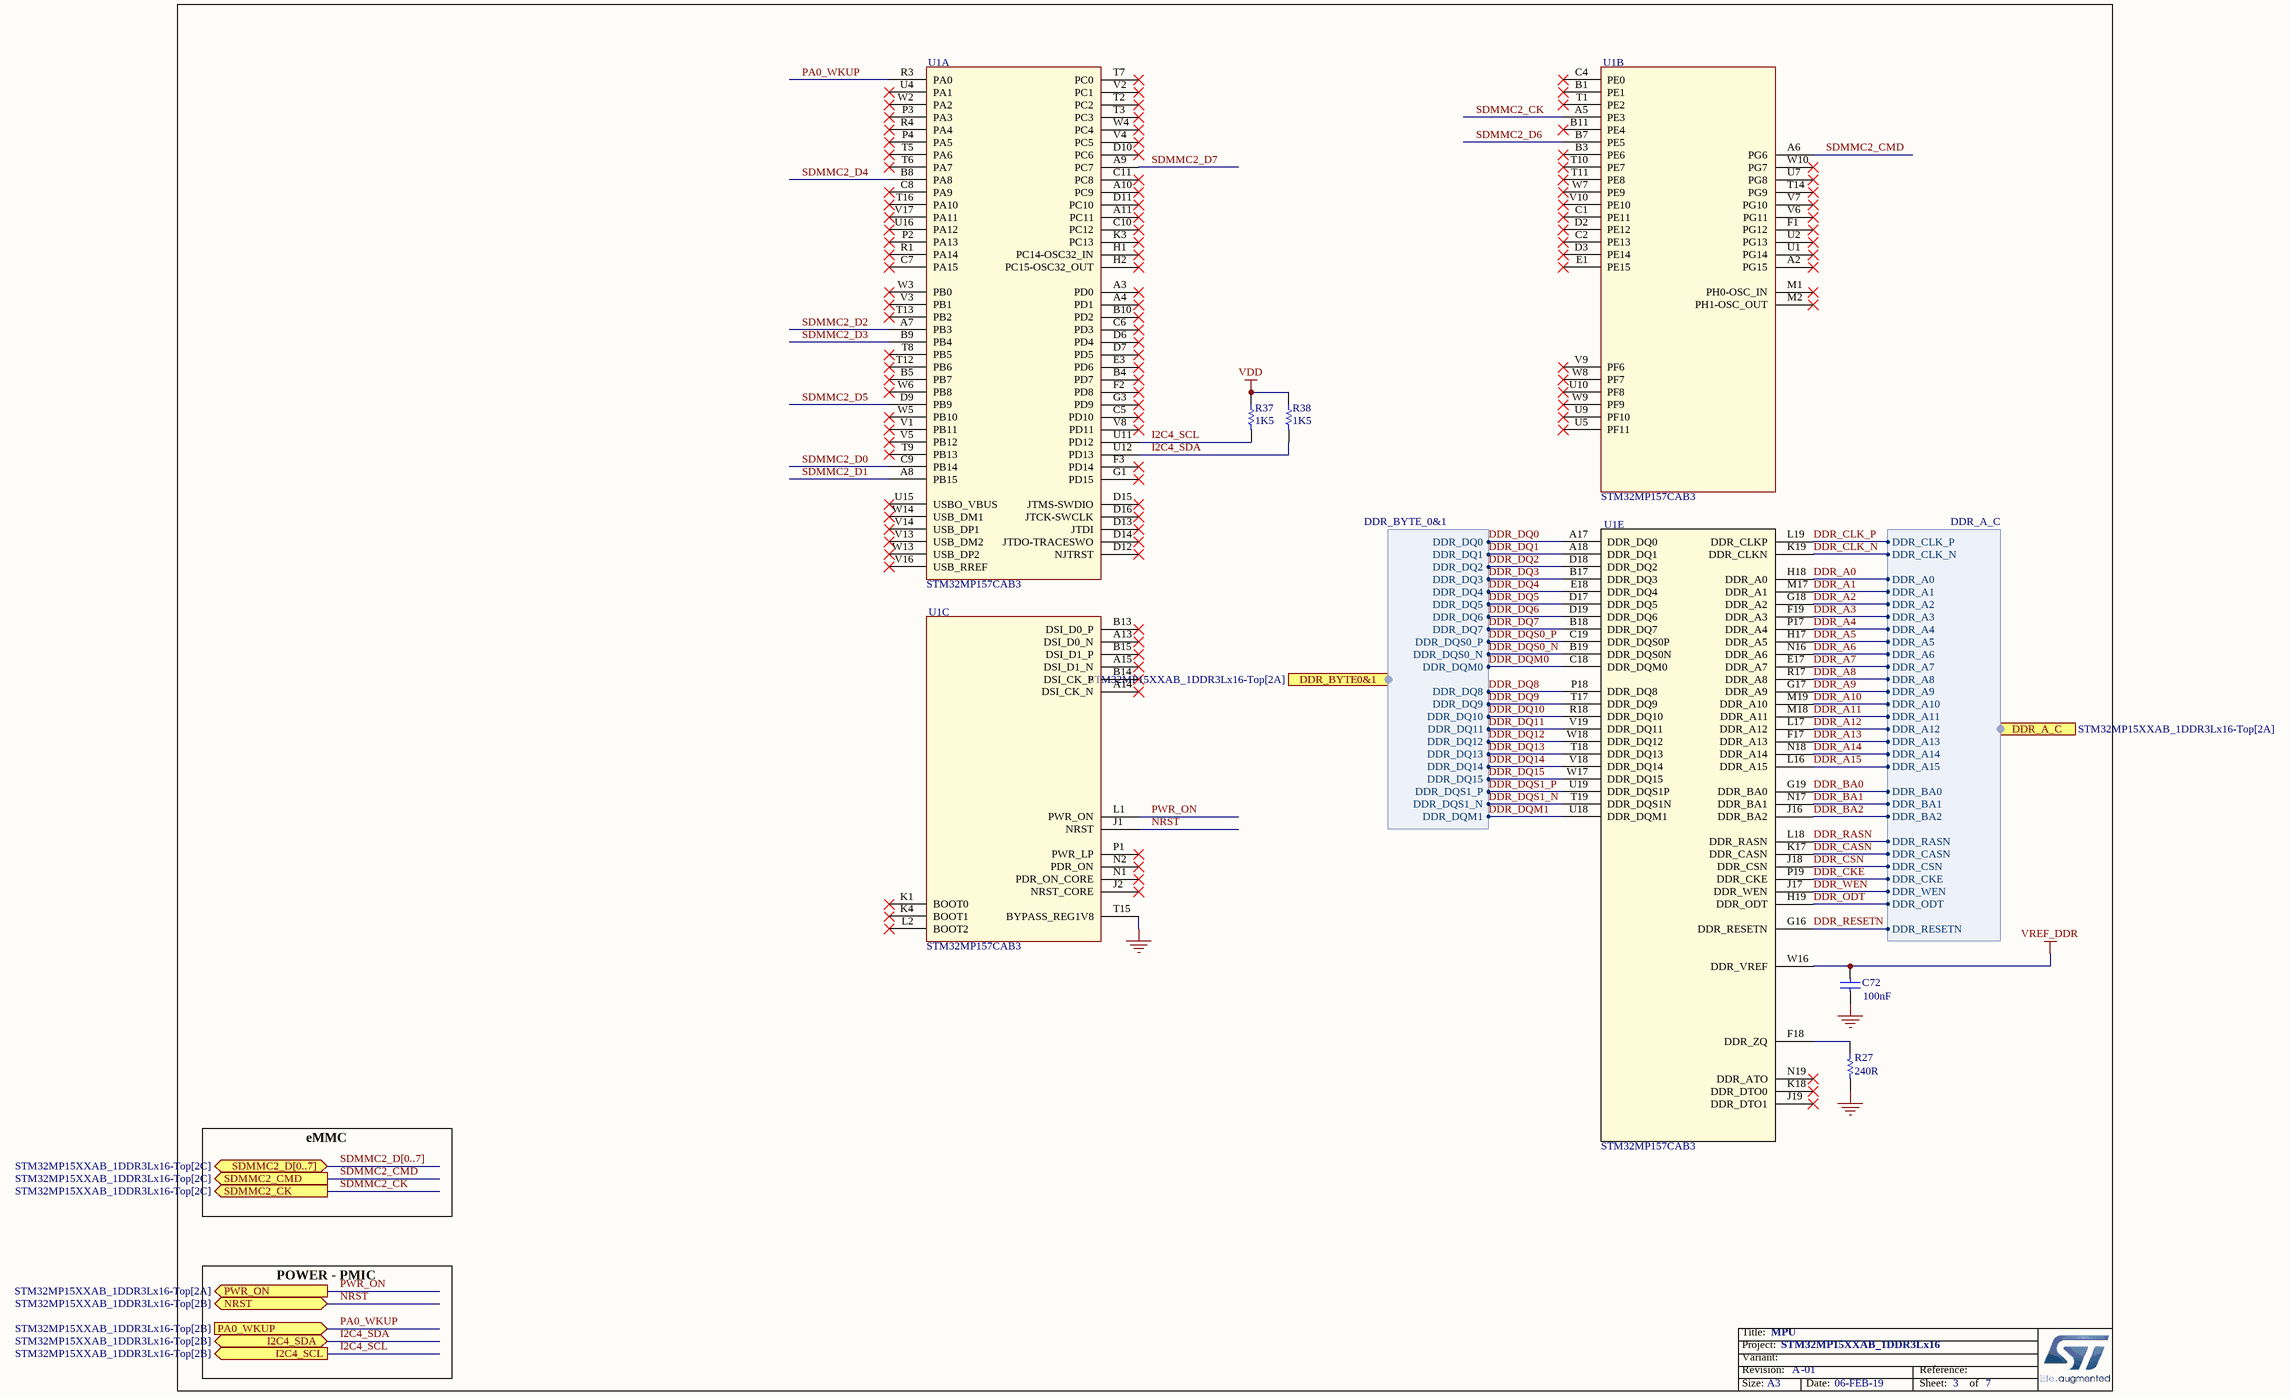
[diagram p5: STM32_MPU_IOs.SchDoc]

### Parts
C72  value 100nF  [C0402]
R27  value 240R  [R0402]
R37  value 1K5  [R0402]
R38  value 1K5  [R0402]
U1  value STM32MP157CAB3  [ICC_LFBGA354_16X16_STM32MP157CAB3_P080]  (parts A,B,C,E of 5)

### Ports
DDR_A_C (harness DDR_A_C, see STM32MP15XXAB_1DDR3Lx16-Top[2A]), DDR_BYTE0&1 (harness DDR_BYTE_0&1, see STM32MP15XXAB_1DDR3Lx16-Top[2A]), I2C4_SCL (out, see STM32MP15XXAB_1DDR3Lx16-Top[2B]), I2C4_SDA (bidir, see STM32MP15XXAB_1DDR3Lx16-Top[2B]), NRST (bidir, see STM32MP15XXAB_1DDR3Lx16-Top[2B]), PA0_WKUP (in, see STM32MP15XXAB_1DDR3Lx16-Top[2B]), PWR_ON (out, see STM32MP15XXAB_1DDR3Lx16-Top[2A]), SDMMC2_CK (out, see STM32MP15XXAB_1DDR3Lx16-Top[2C]), SDMMC2_CMD (out, see STM32MP15XXAB_1DDR3Lx16-Top[2C]), SDMMC2_D[0..7] (bidir, see STM32MP15XXAB_1DDR3Lx16-Top[2C])

### Harnesses
DDR_BYTE_0&1: DDR_DQ0, DDR_DQ1, DDR_DQ2, DDR_DQ3, DDR_DQ4, DDR_DQ5, DDR_DQ6, DDR_DQ7, DDR_DQS0_P, DDR_DQS0_N, DDR_DQM0, DDR_DQ8, DDR_DQ9, DDR_DQ10, DDR_DQ11, DDR_DQ12, DDR_DQ13, DDR_DQ14, DDR_DQ15, DDR_DQS1_P, DDR_DQS1_N, DDR_DQM1
DDR_A_C: DDR_CLK_P, DDR_CLK_N, DDR_A0, DDR_A1, DDR_A2, DDR_A3, DDR_A4, DDR_A5, DDR_A6, DDR_A7, DDR_A8, DDR_A9, DDR_A10, DDR_A11, DDR_A12, DDR_A13, DDR_A14, DDR_BA0, DDR_BA1, DDR_BA2, DDR_RASN, DDR_CASN, DDR_CSN, DDR_CKE, DDR_WEN, DDR_ODT, DDR_RESETN, DDR_A15

### Nets
GND: C72.1 R27.2 U1.T15(BYPASS_REG1V8)
VDD: R37.1 R38.1
VREF_DDR: C72.2 U1.W16(DDR_VREF)
DDR_A0: U1.H18(DDR_A0) ; port DDR_A_C.DDR_A0
DDR_A1: U1.M17(DDR_A1) ; port DDR_A_C.DDR_A1
DDR_A2: U1.G18(DDR_A2) ; port DDR_A_C.DDR_A2
DDR_A3: U1.F19(DDR_A3) ; port DDR_A_C.DDR_A3
DDR_A4: U1.P17(DDR_A4) ; port DDR_A_C.DDR_A4
DDR_A5: U1.H17(DDR_A5) ; port DDR_A_C.DDR_A5
DDR_A6: U1.N16(DDR_A6) ; port DDR_A_C.DDR_A6
DDR_A7: U1.E17(DDR_A7) ; port DDR_A_C.DDR_A7
DDR_A8: U1.R17(DDR_A8) ; port DDR_A_C.DDR_A8
DDR_A9: U1.G17(DDR_A9) ; port DDR_A_C.DDR_A9
DDR_A10: U1.M19(DDR_A10) ; port DDR_A_C.DDR_A10
DDR_A11: U1.M18(DDR_A11) ; port DDR_A_C.DDR_A11
DDR_A12: U1.L17(DDR_A12) ; port DDR_A_C.DDR_A12
DDR_A13: U1.F17(DDR_A13) ; port DDR_A_C.DDR_A13
DDR_A14: U1.N18(DDR_A14) ; port DDR_A_C.DDR_A14
DDR_A15: U1.L16(DDR_A15) ; port DDR_A_C.DDR_A15
DDR_BA0: U1.G19(DDR_BA0) ; port DDR_A_C.DDR_BA0
DDR_BA1: U1.N17(DDR_BA1) ; port DDR_A_C.DDR_BA1
DDR_BA2: U1.J16(DDR_BA2) ; port DDR_A_C.DDR_BA2
DDR_CASN: U1.K17(DDR_CASN) ; port DDR_A_C.DDR_CASN
DDR_CKE: U1.P19(DDR_CKE) ; port DDR_A_C.DDR_CKE
DDR_CLK_N: U1.K19(DDR_CLKN) ; port DDR_A_C.DDR_CLK_N
DDR_CLK_P: U1.L19(DDR_CLKP) ; port DDR_A_C.DDR_CLK_P
DDR_CSN: U1.J18(DDR_CSN) ; port DDR_A_C.DDR_CSN
DDR_DQ0: U1.A17(DDR_DQ0) ; port DDR_BYTE0&1.DDR_DQ0
DDR_DQ1: U1.A18(DDR_DQ1) ; port DDR_BYTE0&1.DDR_DQ1
DDR_DQ2: U1.D18(DDR_DQ2) ; port DDR_BYTE0&1.DDR_DQ2
DDR_DQ3: U1.B17(DDR_DQ3) ; port DDR_BYTE0&1.DDR_DQ3
DDR_DQ4: U1.E18(DDR_DQ4) ; port DDR_BYTE0&1.DDR_DQ4
DDR_DQ5: U1.D17(DDR_DQ5) ; port DDR_BYTE0&1.DDR_DQ5
DDR_DQ6: U1.D19(DDR_DQ6) ; port DDR_BYTE0&1.DDR_DQ6
DDR_DQ7: U1.B18(DDR_DQ7) ; port DDR_BYTE0&1.DDR_DQ7
DDR_DQ8: U1.P18(DDR_DQ8) ; port DDR_BYTE0&1.DDR_DQ8
DDR_DQ9: U1.T17(DDR_DQ9) ; port DDR_BYTE0&1.DDR_DQ9
DDR_DQ10: U1.R18(DDR_DQ10) ; port DDR_BYTE0&1.DDR_DQ10
DDR_DQ11: U1.V19(DDR_DQ11) ; port DDR_BYTE0&1.DDR_DQ11
DDR_DQ12: U1.W18(DDR_DQ12) ; port DDR_BYTE0&1.DDR_DQ12
DDR_DQ13: U1.T18(DDR_DQ13) ; port DDR_BYTE0&1.DDR_DQ13
DDR_DQ14: U1.V18(DDR_DQ14) ; port DDR_BYTE0&1.DDR_DQ14
DDR_DQ15: U1.W17(DDR_DQ15) ; port DDR_BYTE0&1.DDR_DQ15
DDR_DQM0: U1.C18(DDR_DQM0) ; port DDR_BYTE0&1.DDR_DQM0
DDR_DQM1: U1.U18(DDR_DQM1) ; port DDR_BYTE0&1.DDR_DQM1
DDR_DQS0_N: U1.B19(DDR_DQS0N) ; port DDR_BYTE0&1.DDR_DQS0_N
DDR_DQS0_P: U1.C19(DDR_DQS0P) ; port DDR_BYTE0&1.DDR_DQS0_P
DDR_DQS1_N: U1.T19(DDR_DQS1N) ; port DDR_BYTE0&1.DDR_DQS1_N
DDR_DQS1_P: U1.U19(DDR_DQS1P) ; port DDR_BYTE0&1.DDR_DQS1_P
DDR_ODT: U1.H19(DDR_ODT) ; port DDR_A_C.DDR_ODT
DDR_RASN: U1.L18(DDR_RASN) ; port DDR_A_C.DDR_RASN
DDR_RESETN: U1.G16(DDR_RESETN) ; port DDR_A_C.DDR_RESETN
DDR_WEN: U1.J17(DDR_WEN) ; port DDR_A_C.DDR_WEN
I2C4_SCL: R37.2 U1.U11(PD12) ; port I2C4_SCL
I2C4_SDA: R38.2 U1.U12(PD13) ; port I2C4_SDA
NRST: U1.J1(NRST) ; port NRST
PA0_WKUP: U1.R3(PA0) ; port PA0_WKUP
PWR_ON: U1.L1(PWR_ON) ; port PWR_ON
SDMMC2_CK: U1.A5(PE3) ; port SDMMC2_CK
SDMMC2_CMD: U1.A6(PG6) ; port SDMMC2_CMD
SDMMC2_D0: U1.C9(PB14)
SDMMC2_D1: U1.A8(PB15)
SDMMC2_D2: U1.A7(PB3)
SDMMC2_D3: U1.B9(PB4)
SDMMC2_D4: U1.B8(PA8)
SDMMC2_D5: U1.D9(PB9)
SDMMC2_D6: U1.B7(PE5)
SDMMC2_D7: U1.A9(PC7)
NetR27_1: R27.1 U1.F18(DDR_ZQ)

Not connected (* = marked no-connect by the designer): U1 A2(PG15)* A3(PD0)* A4(PD1)* A10(PC9)* A11(PC11)* A13(DSI_D0_N)* A14(DSI_CK_N)* A15(DSI_D1_N)* B1(PE1)* B3(PE6)* B4(PD7)* B5(PB7)* B10(PD2)* B11(PE4)* B13(DSI_D0_P)* B14(DSI_CK_P)* B15(DSI_D1_P)* C1(PE11)* C2(PE13)* C4(PE0)* C5(PD10)* C6(PD3)* C7(PA15)* C8(PA9)* C10(PC12)* C11(PC8)* D2(PE12)* D3(PE14)* D6(PD4)* D7(PD5)* D10(PC6)* D11(PC10)* D12(NJTRST)* D13(JTDI)* D14(JTDO-TRACESWO)* D15(JTMS-SWDIO)* D16(JTCK-SWCLK)* E1(PE15)* E3(PD6)* F1(PG12)* F2(PD8)* F3(PD14)* G1(PD15)* G3(PD9)* H1(PC14-OSC32_IN)* H2(PC15-OSC32_OUT)* J2(NRST_CORE)* J19(DDR_DTO1)* K1(BOOT0)* K3(PC13)* K4(BOOT1)* K18(DDR_DTO0)* L2(BOOT2)* M1(PH0-OSC_IN)* M2(PH1-OSC_OUT)* N1(PDR_ON_CORE)* N2(PDR_ON)* N19(DDR_ATO)* P1(PWR_LP)* P2(PA13)* P3(PA3)* P4(PA5)* R1(PA14)* R4(PA4)* T1(PE2)* T2(PC2)* T3(PC3)* T5(PA6)* T6(PA7)* T7(PC0)* T8(PB5)* T9(PB13)* T10(PE7)* T11(PE8)* T12(PB6)* T13(PB2)* T14(PG9)* T16(PA10)* U1(PG14)* U2(PG13)* U4(PA1)* U5(PF11)* U7(PG8)* U9(PF10)* U10(PF8)* U15(USBO_VBUS)* U16(PA12)* V1(PB11)* V2(PC1)* V3(PB1)* V4(PC5)* V5(PB12)* V6(PG11)* V7(PG10)* V8(PD11)* V9(PF6)* V10(PE10)* V13(USB_DM2)* V14(USB_DP1)* V16(USB_RREF)* V17(PA11)* W2(PA2)* W3(PB0)* W4(PC4)* W5(PB10)* W6(PB8)* W7(PE9)* W8(PF7)* W9(PF9)* W10(PG7)* W13(USB_DP2)* W14(USB_DM1)*

### Buses and harness runs
bus SDMMC2_D[0..7] = port SDMMC2_D[0..7]

### Notes on the sheet
- eMMC
- POWER - PMIC
- Title:
- Project:
- Size:
- Revision:
- Variant:
- A3
- -
- Date:
- Reference:
- Sheet:
- of

### Library data of the parts
C72 = MCD-00006: as C61 on sheet Power_MPU; Internal_Part_Number: MCD-00006; ComponentLink1Description: Datasheet; Status: Released; Part_Type: Capacitor; Package: C0402; ComponentLink1URL: http://tunmcdsvn.tun.st.com/Component_Datasheet_Library/Trunk/Capacitors/Yageo_Multilayer_Capacitor_X7R_series_100pF_to_22uF
R27 = MCD-00120: Resistor,240R,0402,1%,1/16W; Manufacturer_Part_Number: RC0402FR-07240RL; Manufacturer: YAGEO; Provided_By: SUBCO; ECCN_US: EAR99; ECCN_EU: NEC; Internal_Part_Number: MCD-00120; ComponentLink1Description: Datasheet; Status: Released; Part_Type: Resistor; ComponentLink1URL: http://tunmcdsvn.tun.st.com/Component_Datasheet_Library/Trunk/Resistors/Yageo_Resistor_RC0402-series; Package: R0402
R37 R38 = MCD-00068: Resistor,1K5,0402,1%,1/16W; Manufacturer_Part_Number: RC0402FR-071K5L; Manufacturer: YAGEO; Provided_By: SUBCO; ECCN_US: EAR99; ECCN_EU: NEC; Internal_Part_Number: MCD-00068; ComponentLink1Description: Datasheet; Status: Released; Part_Type: Resistor; ComponentLink1URL: http://tunmcdsvn.tun.st.com/Component_Datasheet_Library/Trunk/Resistors/Yageo_Resistor_RC0402-series; Package: R0402
U1 = MCD-01805: as U1 on sheet Power_MPU; Internal_Part_Number: MCD-01805; Status: Checked; Manufacturer_Part_Number: STM32MP157CAB3; Package: LFBGA; ComponentLink1Description: Datasheet; ComponentLink1URL: TBD

## Sheet 1DDR3L_16bits.SchDoc: 1DDR3L_16bits
size A3; Date: Not used; ApprovedBy: Not used; CheckedBy: Not used; Author: Not used; CompanyName: STMicroelectronics; DrawnBy: Not used; Engineer: Not used; Organization: Not used; Address1: Not used; Address2: Not used; Address3: Not used; Address4: Not used; DocumentNumber: Not used; Revision: Not used; SheetNumber: 7; SheetTotal: 7; CurrentTime: Not used; CurrentDate: Not used; Time: Not used; DocumentFullPathAndName: Not used; DocumentName: Not used; ModifiedDate: Not used; ImagePath: Not used; Application_BuildNumber: Not used
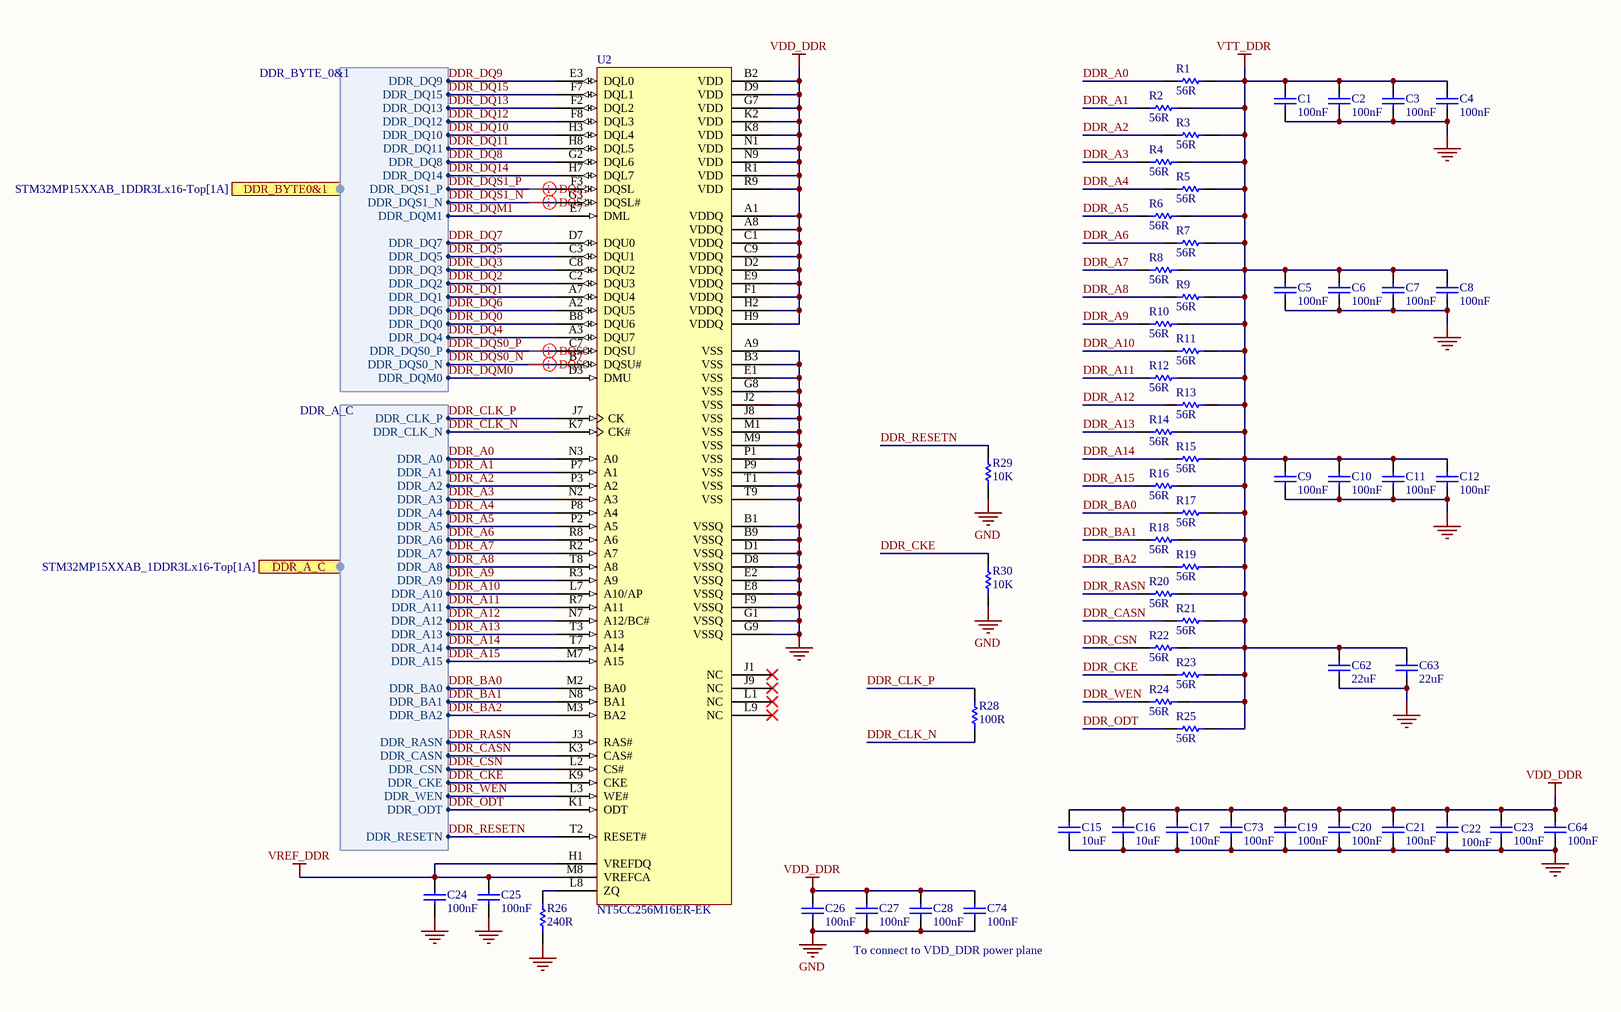
[diagram p6: 1DDR3L_16bits.SchDoc]

### Parts
C1  value 100nF  [C0402]
C2  value 100nF  [C0402]
C3  value 100nF  [C0402]
C4  value 100nF  [C0402]
C5  value 100nF  [C0402]
C6  value 100nF  [C0402]
C7  value 100nF  [C0402]
C8  value 100nF  [C0402]
C9  value 100nF  [C0402]
C10  value 100nF  [C0402]
C11  value 100nF  [C0402]
C12  value 100nF  [C0402]
C15  value 10uF  [C0603]
C16  value 10uF  [C0603]
C17  value 100nF  [C0402]
C19  value 100nF  [C0402]
C20  value 100nF  [C0402]
C21  value 100nF  [C0402]
C22  value 100nF  [C0402]
C23  value 100nF  [C0402]
C24  value 100nF  [C0402]
C25  value 100nF  [C0402]
C26  value 100nF  [C0402]
C27  value 100nF  [C0402]
C28  value 100nF  [C0402]
C62  value 22uF  [C0603]
C63  value 22uF  [C0603]
C64  value 100nF  [C0402]
C73  value 100nF  [C0402]
C74  value 100nF  [C0402]
R1  value 56R  [R0402]
R2  value 56R  [R0402]
R3  value 56R  [R0402]
R4  value 56R  [R0402]
R5  value 56R  [R0402]
R6  value 56R  [R0402]
R7  value 56R  [R0402]
R8  value 56R  [R0402]
R9  value 56R  [R0402]
R10  value 56R  [R0402]
R11  value 56R  [R0402]
R12  value 56R  [R0402]
R13  value 56R  [R0402]
R14  value 56R  [R0402]
R15  value 56R  [R0402]
R16  value 56R  [R0402]
R17  value 56R  [R0402]
R18  value 56R  [R0402]
R19  value 56R  [R0402]
R20  value 56R  [R0402]
R21  value 56R  [R0402]
R22  value 56R  [R0402]
R23  value 56R  [R0402]
R24  value 56R  [R0402]
R25  value 56R  [R0402]
R26  value 240R  [R0402]
R28  value 100R  [R0402]
R29  value 10K  [R0402]
R30  value 10K  [R0402]
U2  value NT5CC256M16ER-EK  [ICC_VFBGA96_9x13_P080]

### Ports
DDR_A_C (harness DDR_A_C, see STM32MP15XXAB_1DDR3Lx16-Top[1A]), DDR_BYTE0&1 (harness DDR_BYTE_0&1, see STM32MP15XXAB_1DDR3Lx16-Top[1A])

### Harnesses
DDR_BYTE_0&1: DDR_DQ10, DDR_DQ9, DDR_DQ13, DDR_DQ15, DDR_DQ8, DDR_DQ12, DDR_DQ11, DDR_DQ14, DDR_DQS1_P, DDR_DQS1_N, DDR_DQ3, DDR_DQM1, DDR_DQ7, DDR_DQ1, DDR_DQ5, DDR_DQ2, DDR_DQ6, DDR_DQ0, DDR_DQ4, DDR_DQS0_P, DDR_DQS0_N, DDR_DQM0
DDR_A_C: DDR_A4, DDR_A0, DDR_A2, DDR_A1, DDR_A6, DDR_A3, DDR_A5, DDR_A7, DDR_A8, DDR_A9, DDR_A14, DDR_A10, DDR_A12, DDR_A11, DDR_BA0, DDR_A13, DDR_A15, DDR_BA1, DDR_BA2, DDR_RASN, DDR_CASN, DDR_CSN, DDR_CKE, DDR_WEN, DDR_ODT, DDR_CLK_P, DDR_CLK_N, DDR_RESETN

### Nets
GND: C1.1 C2.1 C3.1 C4.1 C5.1 C6.1 C7.1 C8.1 C9.1 C10.1 C11.1 C12.1 C15.1 C16.1 C17.1 C19.1 C20.1 C21.1 C22.2 C23.1 C24.1 C25.1 C26.1 C27.1 C28.1 C62.1 C63.1 C64.1 C73.1 C74.1 R26.1 R29.1 R30.1 U2.A9(VSS) U2.B1(VSSQ) U2.B3(VSS) U2.B9(VSSQ) U2.D1(VSSQ) U2.D8(VSSQ) U2.E1(VSS) U2.E2(VSSQ) U2.E8(VSSQ) U2.F9(VSSQ) U2.G1(VSSQ) U2.G8(VSS) U2.G9(VSSQ) U2.J2(VSS) U2.J8(VSS) U2.M1(VSS) U2.M9(VSS) U2.P1(VSS) U2.P9(VSS) U2.T1(VSS) U2.T9(VSS)
VDD_DDR: C15.2 C16.2 C17.2 C19.2 C20.2 C21.2 C22.1 C23.2 C26.2 C27.2 C28.2 C64.2 C73.2 C74.2 U2.A1(VDDQ) U2.A8(VDDQ) U2.B2(VDD) U2.C1(VDDQ) U2.C9(VDDQ) U2.D2(VDDQ) U2.D9(VDD) U2.E9(VDDQ) U2.F1(VDDQ) U2.G7(VDD) U2.H2(VDDQ) U2.H9(VDDQ) U2.K2(VDD) U2.K8(VDD) U2.N1(VDD) U2.N9(VDD) U2.R1(VDD) U2.R9(VDD)
VREF_DDR: C24.2 C25.2 U2.H1(VREFDQ) U2.M8(VREFCA)
VTT_DDR: C1.2 C2.2 C3.2 C4.2 C5.2 C6.2 C7.2 C8.2 C9.2 C10.2 C11.2 C12.2 C62.2 C63.2 R1.2 R2.2 R3.2 R4.2 R5.2 R6.2 R7.2 R8.2 R9.2 R10.2 R11.2 R12.2 R13.2 R14.2 R15.2 R16.2 R17.2 R18.2 R19.2 R20.2 R21.2 R22.2 R23.2 R24.2 R25.2
DDR_A0: R1.1 U2.N3(A0) ; port DDR_A_C.DDR_A0
DDR_A1: R2.1 U2.P7(A1) ; port DDR_A_C.DDR_A1
DDR_A2: R3.1 U2.P3(A2) ; port DDR_A_C.DDR_A2
DDR_A3: R4.1 U2.N2(A3) ; port DDR_A_C.DDR_A3
DDR_A4: R5.1 U2.P8(A4) ; port DDR_A_C.DDR_A4
DDR_A5: R6.1 U2.P2(A5) ; port DDR_A_C.DDR_A5
DDR_A6: R7.1 U2.R8(A6) ; port DDR_A_C.DDR_A6
DDR_A7: R8.1 U2.R2(A7) ; port DDR_A_C.DDR_A7
DDR_A8: R9.1 U2.T8(A8) ; port DDR_A_C.DDR_A8
DDR_A9: R10.1 U2.R3(A9) ; port DDR_A_C.DDR_A9
DDR_A10: R11.1 U2.L7(A10/AP) ; port DDR_A_C.DDR_A10
DDR_A11: R12.1 U2.R7(A11) ; port DDR_A_C.DDR_A11
DDR_A12: R13.1 U2.N7(A12/BC#) ; port DDR_A_C.DDR_A12
DDR_A13: R14.1 U2.T3(A13) ; port DDR_A_C.DDR_A13
DDR_A14: R15.1 U2.T7(A14) ; port DDR_A_C.DDR_A14
DDR_A15: R16.1 U2.M7(A15) ; port DDR_A_C.DDR_A15
DDR_BA0: R17.1 U2.M2(BA0) ; port DDR_A_C.DDR_BA0
DDR_BA1: R18.1 U2.N8(BA1) ; port DDR_A_C.DDR_BA1
DDR_BA2: R19.1 U2.M3(BA2) ; port DDR_A_C.DDR_BA2
DDR_CASN: R21.1 U2.K3(CAS#) ; port DDR_A_C.DDR_CASN
DDR_CKE: R23.1 R30.2 U2.K9(CKE) ; port DDR_A_C.DDR_CKE
DDR_CLK_N: R28.1 U2.K7(CK#) ; port DDR_A_C.DDR_CLK_N
DDR_CLK_P: R28.2 U2.J7(CK) ; port DDR_A_C.DDR_CLK_P
DDR_CSN: R22.1 U2.L2(CS#) ; port DDR_A_C.DDR_CSN
DDR_DQ0: U2.B8(DQU6) ; port DDR_BYTE0&1.DDR_DQ0
DDR_DQ1: U2.A7(DQU4) ; port DDR_BYTE0&1.DDR_DQ1
DDR_DQ2: U2.C2(DQU3) ; port DDR_BYTE0&1.DDR_DQ2
DDR_DQ3: U2.C8(DQU2) ; port DDR_BYTE0&1.DDR_DQ3
DDR_DQ4: U2.A3(DQU7) ; port DDR_BYTE0&1.DDR_DQ4
DDR_DQ5: U2.C3(DQU1) ; port DDR_BYTE0&1.DDR_DQ5
DDR_DQ6: U2.A2(DQU5) ; port DDR_BYTE0&1.DDR_DQ6
DDR_DQ7: U2.D7(DQU0) ; port DDR_BYTE0&1.DDR_DQ7
DDR_DQ8: U2.G2(DQL6) ; port DDR_BYTE0&1.DDR_DQ8
DDR_DQ9: U2.E3(DQL0) ; port DDR_BYTE0&1.DDR_DQ9
DDR_DQ10: U2.H3(DQL4) ; port DDR_BYTE0&1.DDR_DQ10
DDR_DQ11: U2.H8(DQL5) ; port DDR_BYTE0&1.DDR_DQ11
DDR_DQ12: U2.F8(DQL3) ; port DDR_BYTE0&1.DDR_DQ12
DDR_DQ13: U2.F2(DQL2) ; port DDR_BYTE0&1.DDR_DQ13
DDR_DQ14: U2.H7(DQL7) ; port DDR_BYTE0&1.DDR_DQ14
DDR_DQ15: U2.F7(DQL1) ; port DDR_BYTE0&1.DDR_DQ15
DDR_DQM0: U2.D3(DMU) ; port DDR_BYTE0&1.DDR_DQM0
DDR_DQM1: U2.E7(DML) ; port DDR_BYTE0&1.DDR_DQM1
DDR_DQS0_N: U2.B7(DQSU#) ; port DDR_BYTE0&1.DDR_DQS0_N
DDR_DQS0_P: U2.C7(DQSU) ; port DDR_BYTE0&1.DDR_DQS0_P
DDR_DQS1_N: U2.G3(DQSL#) ; port DDR_BYTE0&1.DDR_DQS1_N
DDR_DQS1_P: U2.F3(DQSL) ; port DDR_BYTE0&1.DDR_DQS1_P
DDR_ODT: R25.1 U2.K1(ODT) ; port DDR_A_C.DDR_ODT
DDR_RASN: R20.1 U2.J3(RAS#) ; port DDR_A_C.DDR_RASN
DDR_RESETN: R29.2 U2.T2(RESET#) ; port DDR_A_C.DDR_RESETN
DDR_WEN: R24.1 U2.L3(WE#) ; port DDR_A_C.DDR_WEN
NetR26_2: R26.2 U2.L8(ZQ)

Not connected (* = marked no-connect by the designer): U2 J1(NC)* J9(NC)* L1(NC)* L9(NC)*

### Layout directives
differential pair: DDR_DQS0_N, DDR_DQS0_P, DDR_DQS1_N, DDR_DQS1_P

### Notes on the sheet
- To connect to VDD_DDR power plane
- Title:
- Project:
- Size:
- Revision:
- Variant:
- A3
- -
- Date:
- Reference:
- Sheet:
- of

### Library data of the parts
C1-C12 C17 C19-C28 C64 C73 C74 = MCD-00006: as C61 on sheet Power_MPU; Internal_Part_Number: MCD-00006; Status: Released; Package: C0402; ComponentLink1Description: Datasheet; Part_Type: Capacitor; ComponentLink1URL: http://tunmcdsvn.tun.st.com/Component_Datasheet_Library/Trunk/Capacitors/Yageo_Multilayer_Capacitor_X7R_series_100pF_to_22uF
C15 C16 = MCD-00099: as C18 on sheet Power_PMIC; Internal_Part_Number: MCD-00099; Status: Released; Part_Type: Capacitor; Package: C0603; ComponentLink1Description: Datasheet; ComponentLink1URL: http://tunmcdsvn.tun.st.com/Component_Datasheet_Library/Trunk/Capacitors/Murata_Capacitor_GR_series
C62 C63 = MCD-00100: as C29 on sheet Power_PMIC; Internal_Part_Number: MCD-00100; Status: Released; Part_Type: Capacitor; Package: C0603; ComponentLink1Description: Datasheet; ComponentLink1URL: http://tunmcdsvn.tun.st.com/Component_Datasheet_Library/Trunk/Capacitors/Murata_Capacitor_GR_series
R1-R25 = MCD-00118: Resistor,56R,0402,1%,1/16W; Manufacturer_Part_Number: RC0402FR-0756RL; Manufacturer: YAGEO; Provided_By: SUBCO; ECCN_US: EAR99; ECCN_EU: NEC; Internal_Part_Number: MCD-00118; Status: Released; ComponentLink1Description: Datasheet; Part_Type: Resistor; Package: R0402; ComponentLink1URL: http://tunmcdsvn.tun.st.com/Component_Datasheet_Library/Trunk/Resistors/Yageo_Resistor_RC0402-series
R26 = MCD-00120: as R27 on sheet STM32_MPU_IOs; Internal_Part_Number: MCD-00120; Status: Released; ComponentLink1Description: Datasheet; Part_Type: Resistor; Package: R0402; ComponentLink1URL: http://tunmcdsvn.tun.st.com/Component_Datasheet_Library/Trunk/Resistors/Yageo_Resistor_RC0402-series
R28 = MCD-00119: Resistor,100R,0402,1%,1/16W; Manufacturer_Part_Number: RC0402FR-07100RL; Manufacturer: YAGEO; Provided_By: SUBCO; ECCN_US: EAR99; ECCN_EU: NEC; Internal_Part_Number: MCD-00119; Status: Released; Part_Type: Resistor; Package: R0402; ComponentLink1Description: Datasheet; ComponentLink1URL: http://tunmcdsvn.tun.st.com/Component_Datasheet_Library/Trunk/Resistors/Yageo_Resistor_RC0402-series
R29 R30 = MCD-00053: as R40 on sheet eMMC; Internal_Part_Number: MCD-00053; Status: Released; ComponentLink1Description: Datasheet; Part_Type: Resistor; Package: R0402; ComponentLink1URL: http://tunmcdsvn.tun.st.com/Component_Datasheet_Library/Trunk/Resistors/Yageo_Resistor_RC0402-series
U2 = MCD-01811: Memory,DDR3L,4Gb,256Mbx16,933Mhz,1V35,TFBGA; Part_Type: IC; Manufacturer: NANYA; ECCN_US: tbd; Provided_By: SUBCO; Internal_Part_Number: MCD-01811; Status: Released; Manufacturer_Part_Number: NT5CC256M16ER-EK; ComponentLink1Description: Datasheet; ComponentLink1URL: http://tunmcdsvn.tun.st.com/Component_Datasheet_Library/Trunk/IC/Nanya_DDR3_NT5CC256M16ER-EK; ECCN_EU: tbd

## Nets that join several sheets
3V3: Power_PMIC (5 pins), eMMC (6 pins)
GND: Power_PMIC (28 pins), Power_MPU (143 pins), eMMC (17 pins), STM32_MPU_IOs (C72.1 R27.2 U1.T15), 1DDR3L_16bits (54 pins)
VDD: Power_PMIC (C38.2 L3.2 U4.31 U4.42), Power_MPU (28 pins), eMMC (8 pins), STM32_MPU_IOs (R37.1 R38.1)
VDD_CORE: Power_PMIC (C34.2 L1.2 U4.5), Power_MPU (51 pins)
VDD_DDR: Power_PMIC (5 pins), Power_MPU (19 pins), 1DDR3L_16bits (32 pins)
VDD_USB: Power_PMIC (C52.2 U4.39), Power_MPU (C71.2 U1.W12 U1.W15)
VDDA: Power_PMIC (C49.2 U4.20), Power_MPU (R42.1)
VREF_DDR: Power_PMIC (C45.2 U4.16), STM32_MPU_IOs (C72.2 U1.W16), 1DDR3L_16bits (C24.2 C25.2 U2.H1 U2.M8)
VTT_DDR: Power_PMIC (C46.2 U4.14), 1DDR3L_16bits (39 pins)
DDR_A0: STM32_MPU_IOs (U1.H18), 1DDR3L_16bits (R1.1 U2.N3)
DDR_A1: STM32_MPU_IOs (U1.M17), 1DDR3L_16bits (R2.1 U2.P7)
DDR_A2: STM32_MPU_IOs (U1.G18), 1DDR3L_16bits (R3.1 U2.P3)
DDR_A3: STM32_MPU_IOs (U1.F19), 1DDR3L_16bits (R4.1 U2.N2)
DDR_A4: STM32_MPU_IOs (U1.P17), 1DDR3L_16bits (R5.1 U2.P8)
DDR_A5: STM32_MPU_IOs (U1.H17), 1DDR3L_16bits (R6.1 U2.P2)
DDR_A6: STM32_MPU_IOs (U1.N16), 1DDR3L_16bits (R7.1 U2.R8)
DDR_A7: STM32_MPU_IOs (U1.E17), 1DDR3L_16bits (R8.1 U2.R2)
DDR_A8: STM32_MPU_IOs (U1.R17), 1DDR3L_16bits (R9.1 U2.T8)
DDR_A9: STM32_MPU_IOs (U1.G17), 1DDR3L_16bits (R10.1 U2.R3)
DDR_A10: STM32_MPU_IOs (U1.M19), 1DDR3L_16bits (R11.1 U2.L7)
DDR_A11: STM32_MPU_IOs (U1.M18), 1DDR3L_16bits (R12.1 U2.R7)
DDR_A12: STM32_MPU_IOs (U1.L17), 1DDR3L_16bits (R13.1 U2.N7)
DDR_A13: STM32_MPU_IOs (U1.F17), 1DDR3L_16bits (R14.1 U2.T3)
DDR_A14: STM32_MPU_IOs (U1.N18), 1DDR3L_16bits (R15.1 U2.T7)
DDR_A15: STM32_MPU_IOs (U1.L16), 1DDR3L_16bits (R16.1 U2.M7)
DDR_BA0: STM32_MPU_IOs (U1.G19), 1DDR3L_16bits (R17.1 U2.M2)
DDR_BA1: STM32_MPU_IOs (U1.N17), 1DDR3L_16bits (R18.1 U2.N8)
DDR_BA2: STM32_MPU_IOs (U1.J16), 1DDR3L_16bits (R19.1 U2.M3)
DDR_CASN: STM32_MPU_IOs (U1.K17), 1DDR3L_16bits (R21.1 U2.K3)
DDR_CKE: STM32_MPU_IOs (U1.P19), 1DDR3L_16bits (R23.1 R30.2 U2.K9)
DDR_CLK_N: STM32_MPU_IOs (U1.K19), 1DDR3L_16bits (R28.1 U2.K7)
DDR_CLK_P: STM32_MPU_IOs (U1.L19), 1DDR3L_16bits (R28.2 U2.J7)
DDR_CSN: STM32_MPU_IOs (U1.J18), 1DDR3L_16bits (R22.1 U2.L2)
DDR_DQ0: STM32_MPU_IOs (U1.A17), 1DDR3L_16bits (U2.B8)
DDR_DQ1: STM32_MPU_IOs (U1.A18), 1DDR3L_16bits (U2.A7)
DDR_DQ2: STM32_MPU_IOs (U1.D18), 1DDR3L_16bits (U2.C2)
DDR_DQ3: STM32_MPU_IOs (U1.B17), 1DDR3L_16bits (U2.C8)
DDR_DQ4: STM32_MPU_IOs (U1.E18), 1DDR3L_16bits (U2.A3)
DDR_DQ5: STM32_MPU_IOs (U1.D17), 1DDR3L_16bits (U2.C3)
DDR_DQ6: STM32_MPU_IOs (U1.D19), 1DDR3L_16bits (U2.A2)
DDR_DQ7: STM32_MPU_IOs (U1.B18), 1DDR3L_16bits (U2.D7)
DDR_DQ8: STM32_MPU_IOs (U1.P18), 1DDR3L_16bits (U2.G2)
DDR_DQ9: STM32_MPU_IOs (U1.T17), 1DDR3L_16bits (U2.E3)
DDR_DQ10: STM32_MPU_IOs (U1.R18), 1DDR3L_16bits (U2.H3)
DDR_DQ11: STM32_MPU_IOs (U1.V19), 1DDR3L_16bits (U2.H8)
DDR_DQ12: STM32_MPU_IOs (U1.W18), 1DDR3L_16bits (U2.F8)
DDR_DQ13: STM32_MPU_IOs (U1.T18), 1DDR3L_16bits (U2.F2)
DDR_DQ14: STM32_MPU_IOs (U1.V18), 1DDR3L_16bits (U2.H7)
DDR_DQ15: STM32_MPU_IOs (U1.W17), 1DDR3L_16bits (U2.F7)
DDR_DQM0: STM32_MPU_IOs (U1.C18), 1DDR3L_16bits (U2.D3)
DDR_DQM1: STM32_MPU_IOs (U1.U18), 1DDR3L_16bits (U2.E7)
DDR_DQS0_N: STM32_MPU_IOs (U1.B19), 1DDR3L_16bits (U2.B7)
DDR_DQS0_P: STM32_MPU_IOs (U1.C19), 1DDR3L_16bits (U2.C7)
DDR_DQS1_N: STM32_MPU_IOs (U1.T19), 1DDR3L_16bits (U2.G3)
DDR_DQS1_P: STM32_MPU_IOs (U1.U19), 1DDR3L_16bits (U2.F3)
DDR_ODT: STM32_MPU_IOs (U1.H19), 1DDR3L_16bits (R25.1 U2.K1)
DDR_RASN: STM32_MPU_IOs (U1.L18), 1DDR3L_16bits (R20.1 U2.J3)
DDR_RESETN: STM32_MPU_IOs (U1.G16), 1DDR3L_16bits (R29.2 U2.T2)
DDR_WEN: STM32_MPU_IOs (U1.J17), 1DDR3L_16bits (R24.1 U2.L3)
I2C4_SCL: Power_PMIC (U4.4), STM32_MPU_IOs (R37.2 U1.U11)
I2C4_SDA: Power_PMIC (U4.3), STM32_MPU_IOs (R38.2 U1.U12)
NRST: Power_PMIC (U4.1), STM32_MPU_IOs (U1.J1)
PA0_WKUP: Power_PMIC (U4.43), STM32_MPU_IOs (U1.R3)
PWR_ON: Power_PMIC (U4.44), STM32_MPU_IOs (U1.L1)

## Assembly variants
Example: not fitted R34 R42 R42